# EAGLE board PhantomDriver_ER150D (EAGLE 7.4.0), part 1 of 2
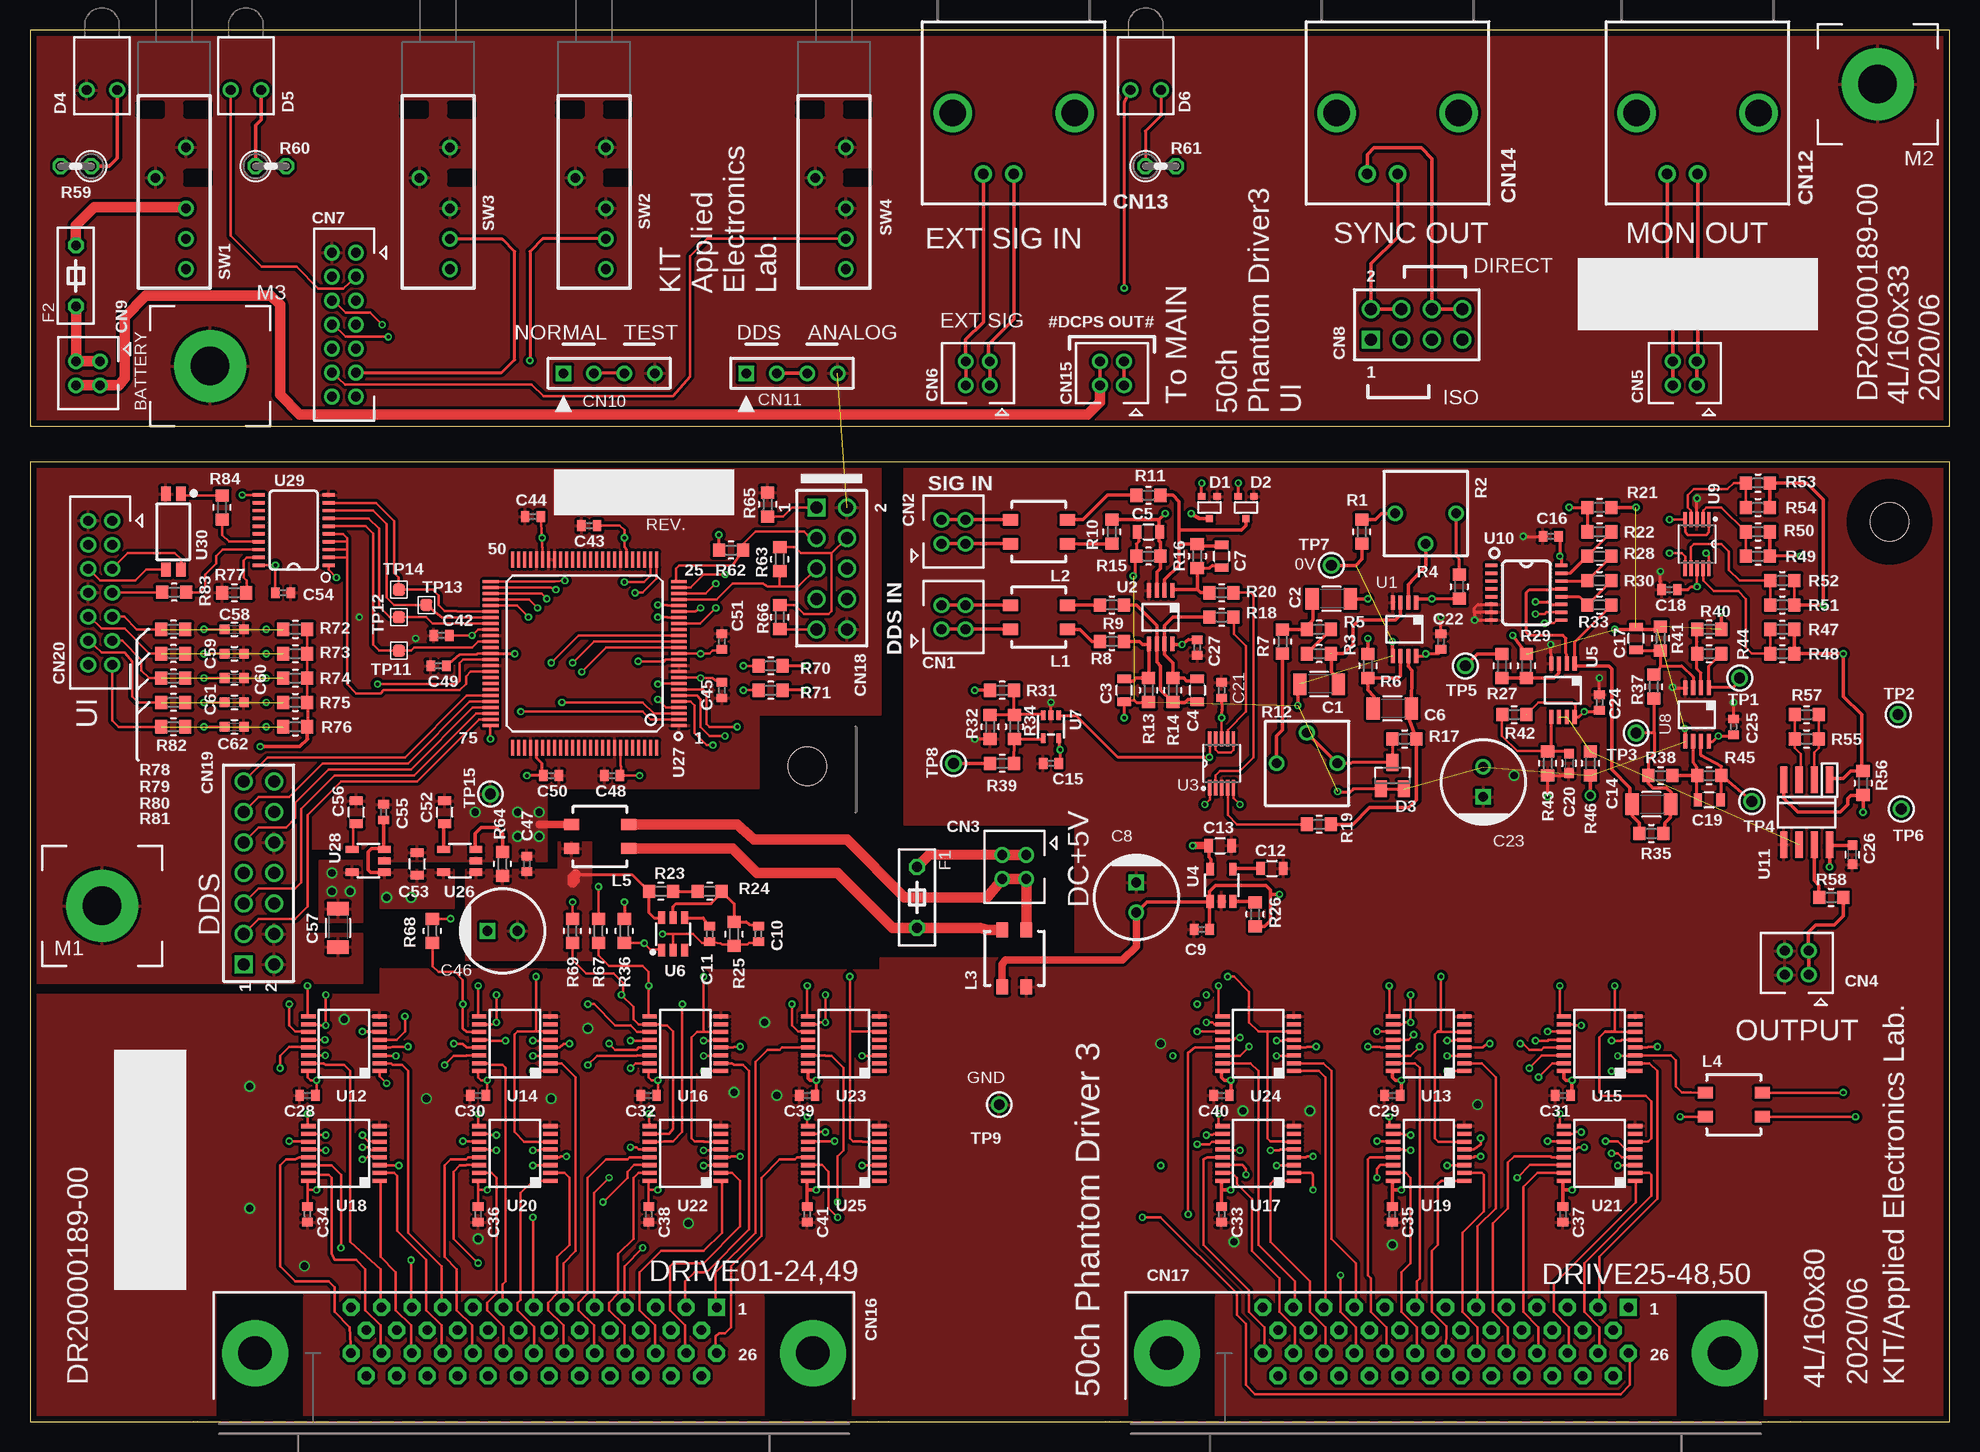
[diagram p5: board, top side]
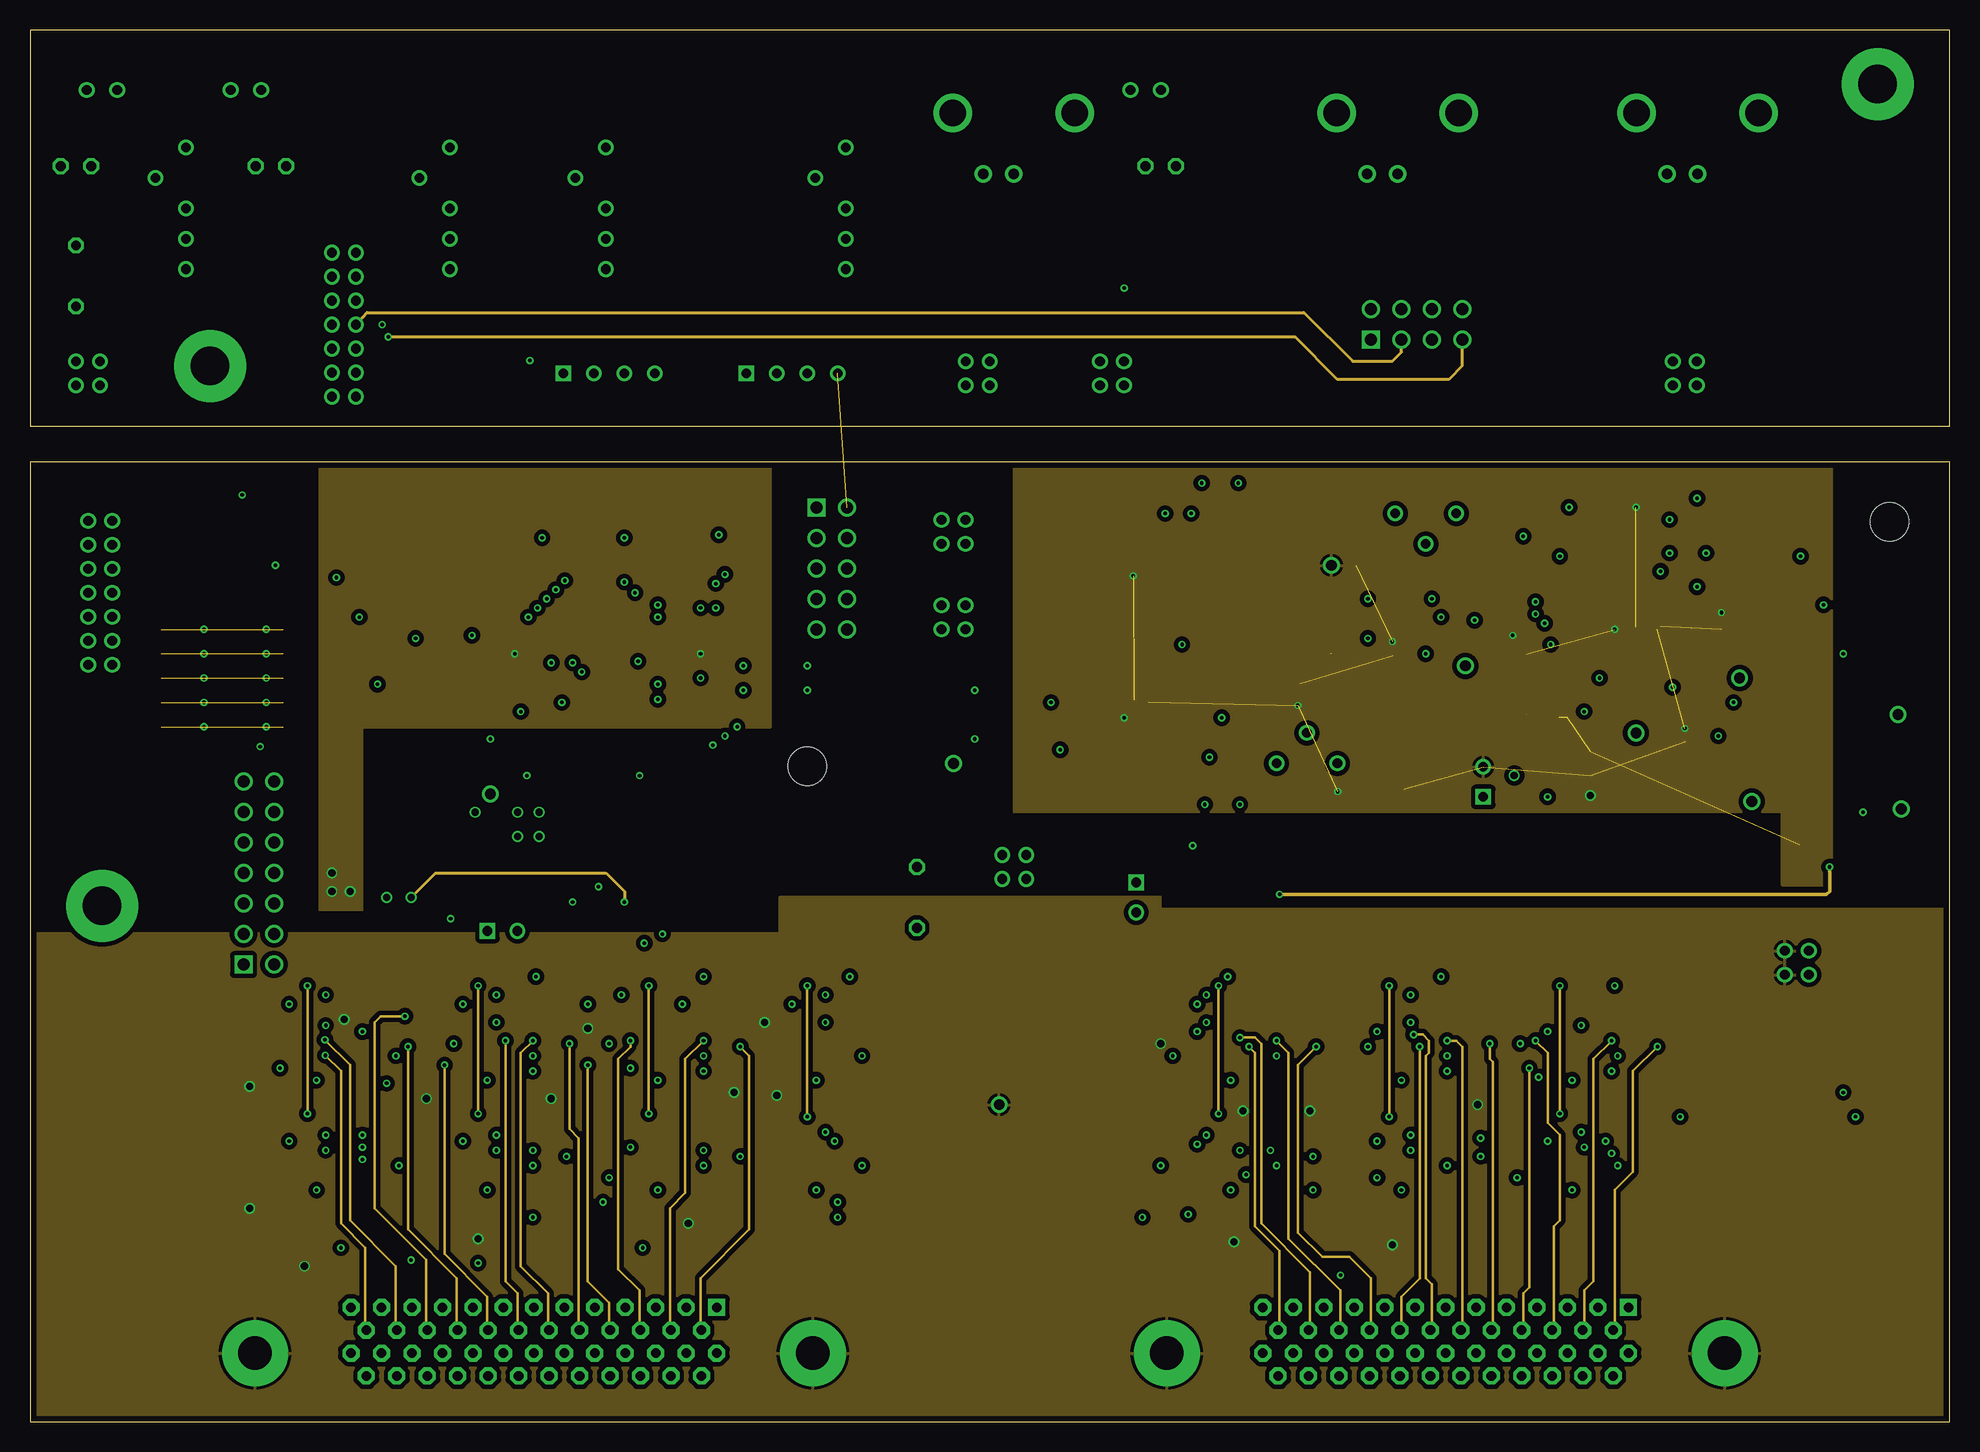
[diagram p6: board, inner layer Route2]
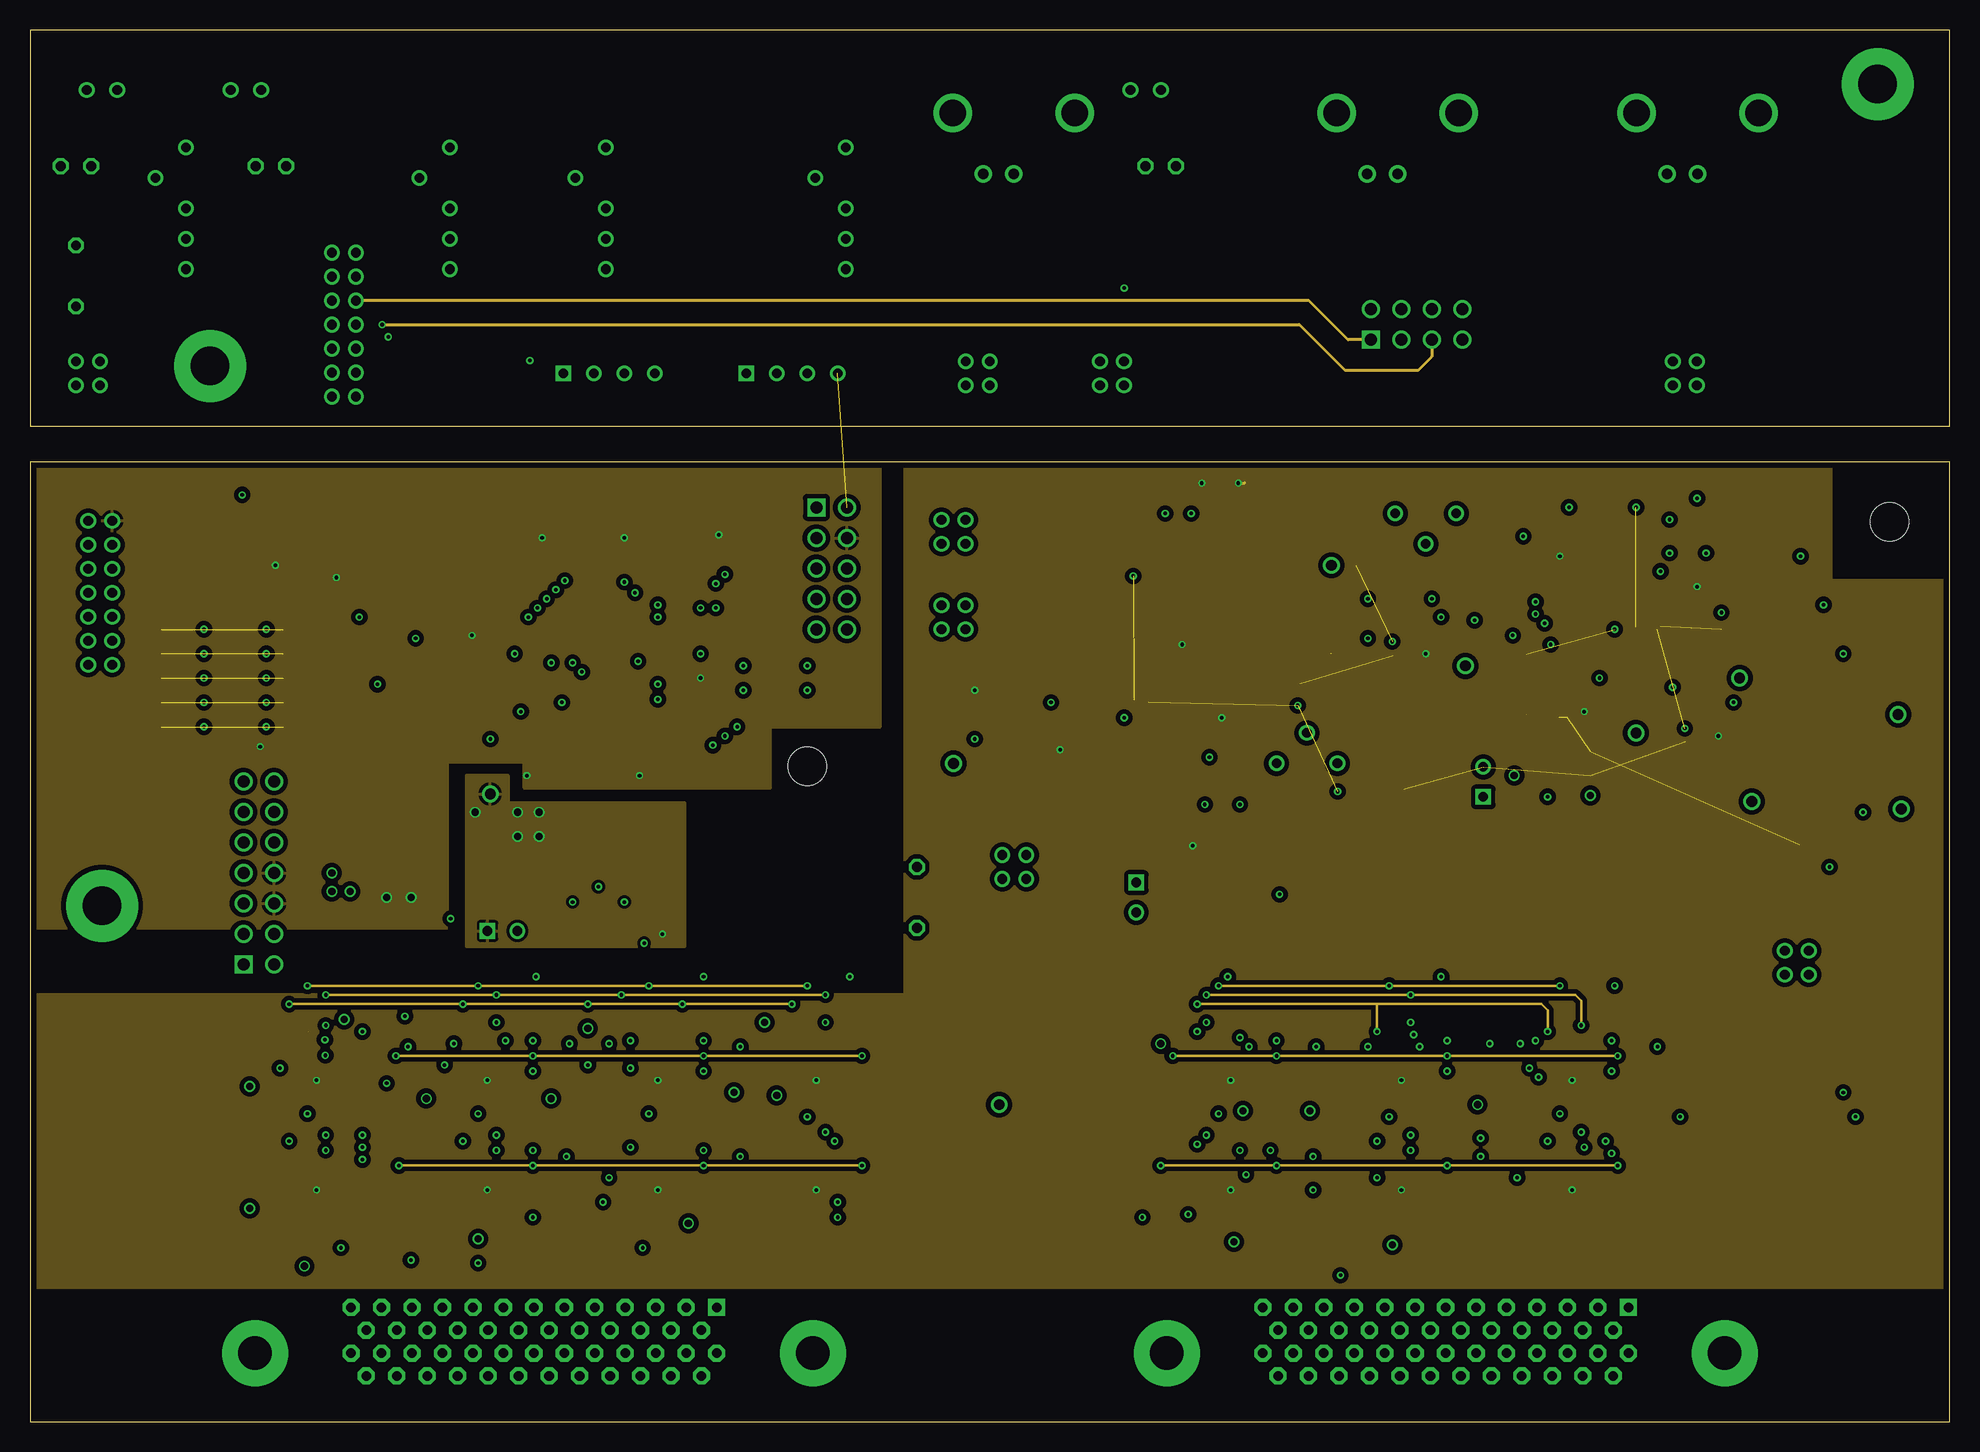
[diagram p7: board, inner layer Route15]
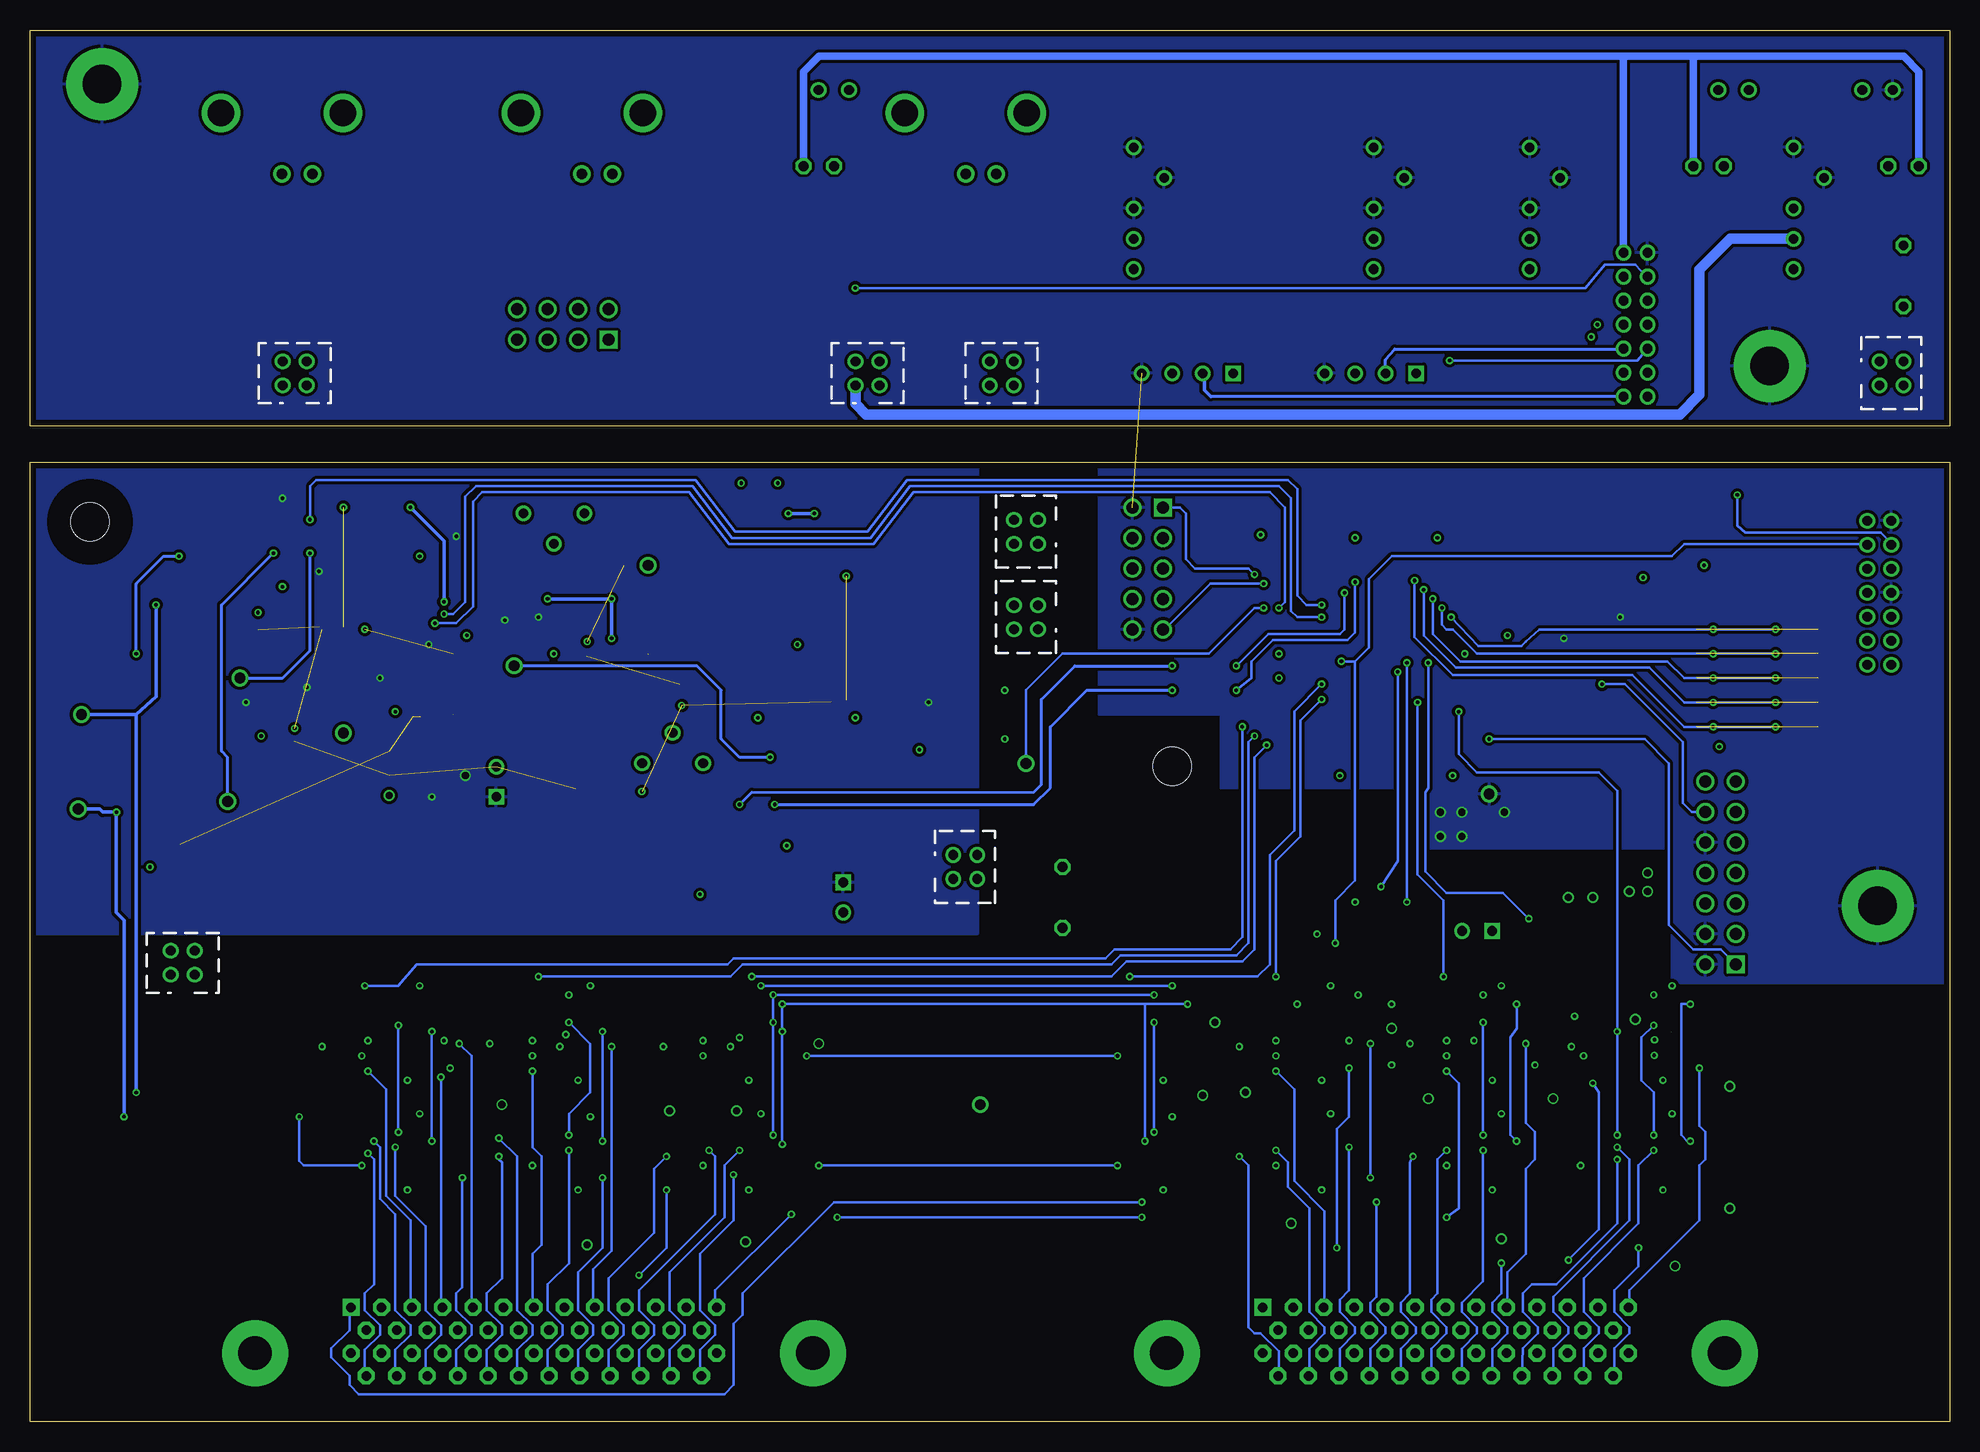
[diagram p8: board, bottom side, seen from below]

Size 160 x 116 mm. Coordinates in mm from the lower left corner, seen from the top.
Outline: 0,0 160,0 160,80 0,80 0,0
Outline: 0,83 160,83 160,116 0,116 0,83
Copper layers (1+2*15+16): Top 0.018mm / dielectric 0.25mm / Route2 0.035mm / dielectric 1mm / Route15 0.035mm / dielectric 0.25mm / Bottom 0.018mm
Design rules "pban_5mil-l4_2019 *": minimum track width 5mil, minimum drill 0.3mm, track to track 0.15mm, track to pad 0.15mm, pad to pad 5mil, via to via 0.3mm, smd to smd 5mil, copper to edge 0.5mm, drill to drill 0.5mm, minimum pad ring 0.25mm, minimum via ring 0.15mm, stop-mask expansion 0.05mm, vias tented up to drill 0.35mm, thermal gap 10mil
Holes 3.2 mm at 155,75
tRestrict: area 151.8,71.8 to 158.2,78.2
bRestrict: area 151.8,71.8 to 158.2,78.2

## Footprints (pad centres in the part's own frame; a part is rotated, then mirrored left to right if it is on the bottom)
CM3216 = smd 1.1 x 1.8: 1 -1.6,0; 2 1.6,0
CM2012 = smd 0.7 x 1.1: 1 -0.95,0; 2 0.95,0
PHI_6.3 = drill 0.8 square: NEG 0,-1.25 | drill 0.8: POS 0,1.25
CM1005 = smd 0.7 x 0.9: 1 -0.65,0; 2 0.65,0
CM1608 = smd 0.8 x 0.8: 1 -0.8,0; 2 0.8,0
DF11-4DP-2DSA = drill 0.8: 1 1,-1; 2 1,1; 3 -1,-1; 4 -1,1
DF11-14DP-2DSA = drill 0.8: 1 6,-1; 2 6,1; 3 4,-1; 4 4,1; 5 2,-1; 6 2,1; 7 0,-1; 8 0,1; 9 -2,-1; 10 -2,1; 11 -4,-1; 12 -4,1; 13 -6,-1; 14 -6,1
PIN_HEADER_8PIN = drill 1 square: 1 -3.81,-1.27 | drill 1: 2 -3.81,1.27; 3 -1.27,-1.27; 4 -1.27,1.27; 5 1.27,-1.27; 6 1.27,1.27; 7 3.81,-1.27; 8 3.81,1.27
PIN_HEADER_4PIN = drill 0.8 square: 1 0,0 | drill 0.8: 2 -2.54,0; 3 -5.08,0; 4 -7.62,0
BNC_F_ANGLE = drill 0.9 pad 1.422: P$1 0,0; P$2 -2.54,0 | drill 2.2: P$3 -5.08,5.08; P$4 5.08,5.08
50LFD2 = drill 0.8 pad 1.422 square: 1 -15.24,-3.815 | drill 0.8 pad 1.422 octagon: 2 -13.97,-1.91; 3 -12.7,-3.815; 4 -11.43,-1.91; 5 -10.16,-3.815; 6 -8.89,-1.91; 7 -7.62,-3.815; 8 -6.35,-1.91; 9 -5.08,-3.815; 10 -3.81,-1.91; 11 -2.54,-3.815; 12 -1.27,-1.91; 13 0,-3.815; 14 1.27,-1.91; 15 2.54,-3.815; 16 3.81,-1.91; 17 5.08,-3.815; 18 6.35,-1.91; 19 7.62,-3.815; 20 8.89,-1.91; 21 10.16,-3.815; 22 11.43,-1.91; 23 12.7,-3.815; 24 13.97,-1.91; 25 15.24,-3.815; 26 -15.24,-0.005; 27 -13.97,1.9; 28 -12.7,-0.005; 29 -11.43,1.9; 30 -10.16,-0.005; 31 -8.89,1.9; 32 -7.62,-0.005; 33 -6.35,1.9; 34 -5.08,-0.005; 35 -3.81,1.9; 36 -2.54,-0.005; 37 -1.27,1.9; 38 0,-0.005; 39 1.27,1.9; 40 2.54,-0.005; 41 3.81,1.9; 42 5.08,-0.005; 43 6.35,1.9; 44 7.62,-0.005; 45 8.89,1.9; 46 10.16,-0.005; 47 11.43,1.9; 48 12.7,-0.005; 49 13.97,1.9; 50 15.24,-0.005 | drill 2.8 pad 5.5: 51 -23.25,0; 52 23.25,0
PIN_HEADER_10PIN = drill 1 square: 1 -5.08,-1.27 | drill 1: 2 -5.08,1.27; 3 -2.54,-1.27; 4 -2.54,1.27; 5 0,-1.27; 6 0,1.27; 7 2.54,-1.27; 8 2.54,1.27; 9 5.08,-1.27; 10 5.08,1.27
PIN_HEADER_SOCKET_14PIN = drill 1 square: 1 -7.62,1.27 | drill 1: 2 -7.62,-1.27; 3 -5.08,1.27; 4 -5.08,-1.27; 5 -2.54,1.27; 6 -2.54,-1.27; 7 0,1.27; 8 0,-1.27; 9 2.54,1.27; 10 2.54,-1.27; 11 5.08,1.27; 12 5.08,-1.27; 13 7.62,1.27; 14 7.62,-1.27
SC70-3-R = smd 0.6 x 0.55: 1 -0.65,-0.925; 2 0.65,-0.925; 3 0,0.925
SOT23 = smd 1 x 1.4: 1 -0.95,-1.1; 2 0.95,-1.1; 3 0,1.1
L-93A8CB = drill 0.8: A 1.27,0; C -1.27,0
8X3/5.08 = drill 0.813 octagon: 1 -2.54,0; 2 2.54,0
ACM4520 = smd 1.25 x 0.95: 1 -2.375,1; 2 -2.375,-1; 3 2.375,-1; 4 2.375,1
VAB_3_10_CONTACT = drill 3.2 pad 6: CASE1 0,0
RM1608 = smd 1 x 1.1: 1 -1,0; 2 1,0
CT-6 = drill 0.8: 1 -2.54,0; 2 0,2.54; 3 2.54,0
0207/2V = drill 0.813 octagon: 1 -1.27,0; 2 1.27,0
A-12* = drill 0.8: 1 2.54,1; 2 0,1; 3 -2.54,1; 7 -7.62,1; 8 -5.08,-1.54
TP_TH_0R9MM = drill 0.9: 1 0,0
TP_PAD_1MM = smd 1 x 1: P$1 0,0
MSO8_AEL = smd 0.34 x 1.19: 1 -0.975,-2.23; 2 -0.325,-2.23; 3 0.325,-2.23; 4 0.975,-2.23; 5 0.975,2.23; 6 0.325,2.23; 7 -0.325,2.23; 8 -0.975,2.23
MSOP10 = smd 1.27 x 0.279: 1 -2.032,0.991; 2 -2.032,0.508; 3 -2.032,0; 4 -2.032,-0.508; 5 -2.032,-0.991; 6 2.032,-0.991; 7 2.032,-0.508; 8 2.032,0; 9 2.032,0.508; 10 2.032,0.991
SOT-23-5 = smd 0.6 x 1.05: 1 -0.95,-1.35; 2 0,-1.35; 3 0.95,-1.35; 4 0.95,1.35; 5 -0.95,1.35
SOT-23 = smd 0.6 x 1.05: 1 -0.95,-1.35; 2 0,-1.35; 3 0.95,-1.35; 4 0.95,1.35; 5 0,1.35; 6 -0.95,1.35
SC88A = smd 0.4 x 0.8: 1 -0.65,-0.95; 2 0,-0.95; 3 0.65,-0.95; 4 0.65,0.95; 5 -0.65,0.95
TSSOP16-P-044-065A = smd 0.29 x 1: 1 -2.275,-2.9; 2 -1.625,-2.9; 3 -0.975,-2.9; 4 -0.325,-2.9; 5 0.325,-2.9; 6 0.975,-2.9; 7 1.625,-2.9; 8 2.275,-2.9; 9 2.275,2.9; 10 1.625,2.9; 11 0.975,2.9; 12 0.325,2.9; 13 -0.325,2.9; 14 -0.975,2.9; 15 -1.625,2.9; 16 -2.275,2.9
SO8_AEL = smd 0.6 x 2.2: 1 -1.905,-2.7; 2 -0.635,-2.7; 3 0.635,-2.7; 4 1.905,-2.7; 5 1.905,2.7; 6 0.635,2.7; 7 -0.635,2.7; 8 -1.905,2.7
TSSOP16_AEL = smd 0.34 x 1.19: 1 -2.275,-2.97; 2 -1.625,-2.97; 3 -0.975,-2.97; 4 -0.325,-2.97; 5 0.325,-2.97; 6 0.975,-2.97; 7 1.625,-2.97; 8 2.275,-2.97; 9 2.275,2.97; 10 1.625,2.97; 11 0.975,2.97; 12 0.325,2.97; 13 -0.325,2.97; 14 -0.975,2.97; 15 -1.625,2.97; 16 -2.275,2.97
QFP100_0.5 = smd 1.3 x 0.25: 1 -7.85,6; 2 -7.85,5.5; 3 -7.85,5; 4 -7.85,4.5; 5 -7.85,4; 6 -7.85,3.5; 7 -7.85,3; 8 -7.85,2.5; 9 -7.85,2; 10 -7.85,1.5; 11 -7.85,1; 12 -7.85,0.5; 13 -7.85,0; 14 -7.85,-0.5; 15 -7.85,-1; 16 -7.85,-1.5; 17 -7.85,-2; 18 -7.85,-2.5; 19 -7.85,-3; 20 -7.85,-3.5; 21 -7.85,-4; 22 -7.85,-4.5; 23 -7.85,-5; 24 -7.85,-5.5; 25 -7.85,-6; 51 7.85,-6; 52 7.85,-5.5; 53 7.85,-5; 54 7.85,-4.5; 55 7.85,-4; 56 7.85,-3.5; 57 7.85,-3; 58 7.85,-2.5; 59 7.85,-2; 60 7.85,-1.5; 61 7.85,-1; 62 7.85,-0.5; 63 7.85,0; 64 7.85,0.5; 65 7.85,1; 66 7.85,1.5; 67 7.85,2; 68 7.85,2.5; 69 7.85,3; 70 7.85,3.5; 71 7.85,4; 72 7.85,4.5; 73 7.85,5; 74 7.85,5.5; 75 7.85,6 | smd 0.25 x 1.3: 26 -6,-7.85; 27 -5.5,-7.85; 28 -5,-7.85; 29 -4.5,-7.85; 30 -4,-7.85; 31 -3.5,-7.85; 32 -3,-7.85; 33 -2.5,-7.85; 34 -2,-7.85; 35 -1.5,-7.85; 36 -1,-7.85; 37 -0.5,-7.85; 38 0,-7.85; 39 0.5,-7.85; 40 1,-7.85; 41 1.5,-7.85; 42 2,-7.85; 43 2.5,-7.85; 44 3,-7.85; 45 3.5,-7.85; 46 4,-7.85; 47 4.5,-7.85; 48 5,-7.85; 49 5.5,-7.85; 50 6,-7.85; 76 6,7.85; 77 5.5,7.85; 78 5,7.85; 79 4.5,7.85; 80 4,7.85; 81 3.5,7.85; 82 3,7.85; 83 2.5,7.85; 84 2,7.85; 85 1.5,7.85; 86 1,7.85; 87 0.5,7.85; 88 0,7.85; 89 -0.5,7.85; 90 -1,7.85; 91 -1.5,7.85; 92 -2,7.85; 93 -2.5,7.85; 94 -3,7.85; 95 -3.5,7.85; 96 -4,7.85; 97 -4.5,7.85; 98 -5,7.85; 99 -5.5,7.85; 100 -6,7.85
TSSOP20-P-0044-065A = smd 0.29 x 1: 1 -2.925,-2.9; 2 -2.275,-2.9; 3 -1.625,-2.9; 4 -0.975,-2.9; 5 -0.325,-2.9; 6 0.325,-2.9; 7 0.975,-2.9; 8 1.625,-2.9; 9 2.275,-2.9; 10 2.925,-2.9; 11 2.925,2.9; 12 2.275,2.9; 13 1.625,2.9; 14 0.975,2.9; 15 0.325,2.9; 16 -0.325,2.9; 17 -0.975,2.9; 18 -1.625,2.9; 19 -2.275,2.9; 20 -2.925,2.9
SO4(11-3C1)(TOSHIBA) = smd 0.8 x 1.2: 1 -0.635,-3.15; 2 0.635,-3.15; 3 0.635,3.15; 4 -0.635,3.15
3MM_STAT = hole 3.2: 0,0

## Placement (x,y rotation side)
C1  47n  [CM3216]  107.46,61.47 180 top
C2  47n  [CM3216]  108.47,68.58 180 top
C3  3.3n  [CM2012]  91.2,60.96 90 top
C4  3.3n  [CM2012]  97.3,60.96 270 top
C5  3.3n  [CM2012]  93.23,74.17 0 top
C6  47n  [CM3216]  113.55,59.44 180 top
C7  3.3n  [CM2012]  99.33,72.14 90 top
C8  56u/10V/OS  [PHI_6.3]  92.22,43.69 180 top
C9  0.1u/16V  [CM1005]  97.68,41.02 180 top
C10  0.1u/16V  [CM1005]  60.72,40.64 270 top
C11  0.1u/16V  [CM1005]  56.66,40.64 270 top
C12  10n  [CM2012]  103.52,46.1 0 top
C13  4.7u/25V  [CM2012]  99.2,48.01 0 top
C14  ---  [CM3216]  135.14,51.44 180 top
C15  0.1u/16V  [CM1005]  85.1,54.86 0 top
C16  0.1u/16V  [CM1005]  126.76,73.79 180 top
C17  4.7n  [CM2012]  133.87,65.28 90 top
C18  0.1u/16V  [CM1005]  136.67,69.34 180 top
C19  2.2n  [CM2012]  139.97,51.82 180 top
C20  1u/25V  [CM1608]  128.28,54.86 270 top
C21  0.1u/16V  [CM1005]  99.33,60.96 90 top
C22  0.1u/16V  [CM1005]  117.62,65.02 90 top
C23  56u/10V/OS  [PHI_6.3]  121.14,53.32 0 top
C24  0.1u/16V  [CM1005]  130.82,59.94 90 top
C25  0.1u/16V  [CM1005]  142,57.91 90 top
C26  1u/25V  [CM1608]  151.91,47.24 90 top
C27  0.1u/16V  [CM1005]  97.3,64.52 270 top
C28  0.1u/16V  [CM1005]  23.13,27.18 180 top
C29  0.1u/16V  [CM1005]  113.55,27.18 180 top
C30  0.1u/16V  [CM1005]  37.35,27.18 180 top
C31  0.1u/16V  [CM1005]  127.78,27.18 180 top
C32  0.1u/16V  [CM1005]  51.58,27.18 180 top
C33  0.1u/16V  [CM1005]  99.33,17.27 270 top
C34  0.1u/16V  [CM1005]  23.13,17.27 270 top
C35  0.1u/16V  [CM1005]  113.55,17.27 270 top
C36  0.1u/16V  [CM1005]  37.35,17.27 270 top
C37  0.1u/16V  [CM1005]  127.78,17.27 270 top
C38  0.1u/16V  [CM1005]  51.58,17.27 270 top
C39  0.1u/16V  [CM1005]  64.78,27.18 180 top
C40  0.1u/16V  [CM1005]  99.33,27.18 180 top
C41  0.1u/16V  [CM1005]  64.78,17.27 270 top
C42  0.1u/16V  [CM1005]  34.3,65.53 180 top
C43  0.1u/16V  [CM1005]  46.62,74.68 180 top
C44  0.1u/16V  [CM1005]  41.92,75.44 180 top
C45  0.1u/16V  [CM1005]  57.67,60.96 270 top
C46  56u/10V/OS  [PHI_6.3]  39.38,40.89 270 top
C47  0.1u/16V  [CM1005]  41.42,46.48 90 top
C48  0.1u/16V  [CM1005]  48.53,53.85 0 top
C49  0.1u/16V  [CM1005]  34.05,62.99 0 top
C50  0.1u/16V  [CM1005]  43.45,53.85 180 top
C51  0.1u/16V  [CM1005]  57.67,65.02 270 top
C52  10n  [CM2012]  34.56,50.8 90 top
C53  4.7u/25V  [CM2012]  32.27,46.48 90 top
C54  0.1u/16V  [CM1005]  21.1,69.09 0 top
C55  0.1u/16V  [CM1005]  29.48,50.8 90 top
C56  10n  [CM2012]  27.19,50.8 90 top
C57  10u/25V  [CM3216]  25.67,41.15 270 top
C58  1u/25V  [CM1608]  17.03,66.04 0 top
C59  1u/25V  [CM1608]  17.03,64.01 0 top
C60  1u/25V  [CM1608]  17.03,61.98 0 top
C61  1u/25V  [CM1608]  17.03,59.94 0 top
C62  1u/25V  [CM1608]  17.03,57.91 0 top
CN1  DF11-4DP-2DSA  [DF11-4DP-2DSA]  76.98,67.06 270 top
CN2  DF11-4DP-2DSA  [DF11-4DP-2DSA]  76.98,74.17 270 top
CN3  DF11-4DP-2DSA  [DF11-4DP-2DSA]  82.06,46.23 90 top
CN4  DF11-4DP-2DSA  [DF11-4DP-2DSA]  147.27,38.24 0 top
CN5  DF11-4DP-2DSA  [DF11-4DP-2DSA]  137.94,87.38 0 top
CN6  DF11-4DP-2DSA  [DF11-4DP-2DSA]  79.01,87.38 0 top
CN7  DF11-14DP-2DSA  [DF11-14DP-2DSA]  26.18,91.44 90 top
CN8  PH-2X4S  [PIN_HEADER_8PIN]  115.58,91.44 0 top
CN9  DF11-4DP-2DSA  [DF11-4DP-2DSA]  4.84,87.38 90 top
CN10  826646-4  [PIN_HEADER_4PIN]  44.46,87.38 180 top
CN11  826646-4  [PIN_HEADER_4PIN]  59.7,87.38 180 top
CN12  BNC_ANGLE  [BNC_F_ANGLE]  139,104 0 top
CN13  BNC_ANGLE  [BNC_F_ANGLE]  82,104 0 top
CN14  BNC_ANGLE  [BNC_F_ANGLE]  114,104 0 top
CN15  DF11-4DP-2DSA  [DF11-4DP-2DSA]  90.18,87.38 0 top
CN16  PCS-XE50LFD  [50LFD2]  42,5.7 180 top
CN17  PCS-XE50LFD  [50LFD2]  118,5.7 180 top
CN18  PH-2X5S  [PIN_HEADER_10PIN]  66.82,71.12 270 top
CN19  PIN_HEADER_SOCKET_14PIN  [PIN_HEADER_SOCKET_14PIN]  19.06,45.72 90 top
CN20  DF11-14DP-2DSA  [DF11-14DP-2DSA]  5.86,69.09 90 top
D1  1SS372  [SC70-3-R]  98.31,76.2 180 top
D2  1SS372  [SC70-3-R]  101.36,76.2 180 top
D3  1SS226  [SOT23]  113.55,53.85 0 top
D4  L-93A8CB/1GD  [L-93A8CB]  6,111 0 top
D5  L-93A8CB/1ID  [L-93A8CB]  18,111 0 top
D6  L-93A8CB/1GD  [L-93A8CB]  93,111 0 top
F1  RXEF050  [8X3/5.08]  73.93,43.69 270 top
F2  RXEF050  [8X3/5.08]  3.82,95.5 90 top
L1  ACM4520-142  [ACM4520]  84.09,67.06 180 top
L2  ACM4520-142  [ACM4520]  84.09,74.17 180 top
L3  ACM4520-142  [ACM4520]  82.06,38.61 90 top
L4  ACM4520-142  [ACM4520]  142,26.42 0 top
L5  ACM4520-142  [ACM4520]  47.51,48.77 180 top
M1  VAB-3-10  [VAB_3_10_CONTACT]  6,43 0 top
M2  VAB-3-10  [VAB_3_10_CONTACT]  154,111.5 0 top
M3  VAB-3-10  [VAB_3_10_CONTACT]  15,88 0 top
R1  100k  [RM1608]  111.01,74.17 90 top
R2  100k/POT  [CT-6]  116.35,75.69 180 top
R3  270k  [RM1608]  107.46,64.01 180 top
R4  47k  [RM1608]  119.14,69.6 270 top
R5  43k  [RM1608]  107.46,66.04 180 top
R6  330k  [RM1608]  111.52,62.99 270 top
R7  270k  [RM1608]  104.41,65.02 270 top
R8  51k  [RM1608]  90.18,65.02 0 top
R9  51k  [RM1608]  90.18,68.07 0 top
R10  51k  [RM1608]  90.18,74.17 90 top
R11  51k  [RM1608]  93.23,77.22 0 top
R12  50k/POT  [CT-6]  106.44,54.86 0 top
R13  51k  [RM1608]  93.23,60.96 270 top
R14  51k  [RM1608]  95.26,60.96 90 top
R15  51k  [RM1608]  93.23,72.14 180 top
R16  51k  [RM1608]  97.3,72.14 270 top
R17  9.1k  [RM1608]  114.57,56.9 0 top
R18  47/THICK  [RM1608]  99.33,67.06 0 top
R19  10k  [RM1608]  107.46,49.78 180 top
R20  10k  [RM1608]  99.33,69.09 0 top
R21  51k  [RM1608]  130.82,76.2 180 top
R22  0  [RM1608]  130.82,74.17 0 top
R23  9.1k  [RM1608]  52.59,44.2 180 top
R24  110k  [RM1608]  56.66,44.2 180 top
R25  11k  [RM1608]  58.69,40.64 90 top
R26  100k/THICK  [RM1608]  102.12,42.29 90 top
R27  0  [RM1608]  122.7,62.99 270 top
R28  0  [RM1608]  130.82,72.14 0 top
R29  10k  [RM1608]  124.73,62.99 270 top
R30  51k  [RM1608]  130.82,70.1 0 top
R31  51k  [RM1608]  81.04,60.96 180 top
R32  51k  [RM1608]  80.02,57.91 90 top
R33  0  [RM1608]  130.82,68.07 0 top
R34  1M/THICK  [RM1608]  82.06,57.91 270 top
R35  0  [RM1608]  135.14,49.02 0 top
R36  100k/THICK  [RM1608]  49.54,40.89 90 top
R37  51k  [RM1608]  135.35,61.26 90 top
R38  51k  [RM1608]  135.9,53.85 0 top
R39  47/THICK  [RM1608]  81.04,54.86 180 top
R40  51k  [RM1608]  139.97,66.04 180 top
R41  51k  [RM1608]  135.9,65.28 270 top
R42  68k  [RM1608]  123.71,58.93 0 top
R43  68k  [RM1608]  126.51,54.86 90 top
R44  51k  [RM1608]  139.97,64.01 0 top
R45  51k  [RM1608]  139.97,53.85 0 top
R46  30/THICK  [RM1608]  130.06,54.86 270 top
R47  100k  [RM1608]  146.06,66.04 0 top
R48  100k  [RM1608]  146.06,64.01 0 top
R49  5.6k  [RM1608]  144.03,72.14 0 top
R50  39k  [RM1608]  144.03,74.17 0 top
R51  100k  [RM1608]  146.06,68.07 0 top
R52  100k  [RM1608]  146.06,70.1 0 top
R53  10k  [RM1608]  144.03,78.23 0 top
R54  10k  [RM1608]  144.03,76.2 0 top
R55  2k/0.05%/10ppm  [RM1608]  148.1,56.9 0 top
R56  100/0.05%/10ppm  [RM1608]  152.79,53.21 270 top
R57  15k/0.05%/10ppm  [RM1608]  148.1,58.93 0 top
R58  620/THICK  [RM1608]  150.13,43.69 0 top
R59  680/LEAD  [0207/2V]  3.82,104.65 180 top
R60  680/LEAD  [0207/2V]  20.08,104.65 0 top
R61  680/LEAD  [0207/2V]  94.25,104.65 0 top
R62  ---  [RM1608]  58.43,72.64 180 top
R63  10k/THICK  [RM1608]  62.5,71.88 90 top
R64  100k/THICK  [RM1608]  39.38,46.48 90 top
R65  1k/THICK  [RM1608]  61.48,76.45 270 top
R66  10k/THICK  [RM1608]  62.5,67.06 90 top
R67  1k/THICK  [RM1608]  47.38,40.89 90 top
R68  1k/THICK  [RM1608]  33.54,40.89 90 top
R69  1k/THICK  [RM1608]  45.23,40.89 90 top
R70  1k/THICK  [RM1608]  61.74,62.99 180 top
R71  1k/THICK  [RM1608]  61.74,60.96 180 top
R72  100k/THICK  [RM1608]  22.11,66.04 0 top
R73  100k/THICK  [RM1608]  22.11,64.01 0 top
R74  100k/THICK  [RM1608]  22.11,61.98 0 top
R75  100k/THICK  [RM1608]  22.11,59.94 0 top
R76  100k/THICK  [RM1608]  22.11,57.91 0 top
R77  100k/THICK  [RM1608]  17.03,69.09 0 top
R78  20k/THICK  [RM1608]  11.95,66.04 180 top
R79  20k/THICK  [RM1608]  11.95,64.01 180 top
R80  20k/THICK  [RM1608]  11.95,61.98 180 top
R81  20k/THICK  [RM1608]  11.95,59.94 180 top
R82  20k/THICK  [RM1608]  11.95,57.91 180 top
R83  1k/THICK  [RM1608]  12.02,69.14 180 top
R84  2k/THICK  [RM1608]  16.02,76.2 90 top
SW1  A-12AV  [A-12*]  12,98.6 270 top
SW2  A-12AV  [A-12*]  47,98.6 270 top
SW3  A-12AV  [A-12*]  34,98.6 270 top
SW4  A-12AV  [A-12*]  67,98.6 270 top
TP1  TP-LC3G  [TP_TH_0R9MM]  142.51,61.98 0 top
TP2  TP-LC3G  [TP_TH_0R9MM]  155.72,58.93 0 top
TP3  TP-LC3G  [TP_TH_0R9MM]  133.87,57.4 0 top
TP4  TP-LC3G  [TP_TH_0R9MM]  143.52,51.69 0 top
TP5  TP-LC3G  [TP_TH_0R9MM]  119.65,62.99 0 top
TP6  TP-LC3G  [TP_TH_0R9MM]  155.97,51.05 0 top
TP7  TP-LC3G  [TP_TH_0R9MM]  108.47,71.37 0 top
TP8  TP-LC3G  [TP_TH_0R9MM]  76.98,54.86 90 top
TP9  TP-LC3G  [TP_TH_0R9MM]  80.79,26.42 180 top
TP11  TP-1MMPAD  [TP_PAD_1MM]  30.75,64.26 0 top
TP12  TP-1MMPAD  [TP_PAD_1MM]  30.75,67.06 0 top
TP13  TP-1MMPAD  [TP_PAD_1MM]  33.03,68.07 0 top
TP14  TP-1MMPAD  [TP_PAD_1MM]  30.75,69.34 0 top
TP15  TP-LC3G  [TP_TH_0R9MM]  38.37,52.32 90 top
U1  OPA2344EA  [MSO8_AEL]  114.57,66.04 180 top
U2  OPA2344EA  [MSO8_AEL]  94.25,67.06 180 top
U3  TS5A23159DGS  [MSOP10]  99.33,54.86 90 top
U4  TPS79933DDC  [SOT-23-5]  99.33,44.7 0 top
U5  OPA2344EA  [MSO8_AEL]  127.78,60.96 180 top
U6  TPS3808G01DBV  [SOT-23]  53.61,40.64 0 top
U7  NJU7108F3  [SC88A]  85.1,57.91 180 top
U8  OPA2344EA  [MSO8_AEL]  138.95,58.93 180 top
U9  TS5A23159DGS  [MSOP10]  138.95,73.15 270 top
U10  74VHC4052AFT  [TSSOP16-P-044-065A]  124.73,69.09 270 top
U11  AD8227ARZ  [SO8_AEL]  148.1,50.8 180 top
U12  MAX4617CUE+  [TSSOP16_AEL]  26.18,31.5 90 top
U13  MAX4617CUE+  [TSSOP16_AEL]  116.6,31.5 90 top
U14  MAX4617CUE+  [TSSOP16_AEL]  40.4,31.5 90 top
U15  MAX4617CUE+  [TSSOP16_AEL]  130.82,31.5 90 top
U16  MAX4617CUE+  [TSSOP16_AEL]  54.62,31.5 90 top
U17  MAX4617CUE+  [TSSOP16_AEL]  102.38,22.35 90 top
U18  MAX4617CUE+  [TSSOP16_AEL]  26.18,22.35 90 top
U19  MAX4617CUE+  [TSSOP16_AEL]  116.6,22.35 90 top
U20  MAX4617CUE+  [TSSOP16_AEL]  40.4,22.35 90 top
U21  MAX4617CUE+  [TSSOP16_AEL]  130.82,22.35 90 top
U22  MAX4617CUE+  [TSSOP16_AEL]  54.62,22.35 90 top
U23  MAX4617CUE+  [TSSOP16_AEL]  67.83,31.5 90 top
U24  MAX4617CUE+  [TSSOP16_AEL]  102.38,31.5 90 top
U25  MAX4617CUE+  [TSSOP16_AEL]  67.83,22.35 90 top
U26  TPS79933DDC  [SOT-23-5]  35.83,46.74 90 top
U27  5M160ZT100  [QFP100_0.5]  46.24,64.01 180 top
U28  TPS79918DDC  [SOT-23-5]  28.21,46.74 90 top
U29  74VHC9541FT  [TSSOP20-P-0044-065A]  21.98,74.31 90 top
U30  TLP291GR  [SO4(11-3C1)(TOSHIBA)]  11.95,74.17 180 top
U$2  [3MM_STAT]  64.78,54.61 0 top

## Tracks (layer width: path | path; a pad name or v marks a point on that pad's centre or on a via)
0V  (via drill 0.3, 0.6)  (12 unrouted)
  Top 0.254: R13.2 93.22,59.94 92.22,59.94 92,60.16 C3.1 v91.2,58.67 | C5.1 92.43,73.37 92.22,73.15 92.22,72.15 R15.2 92.23,72.03 92.09,71.88 92.09,70.61 v91.96,70.48 | D3.2 D3.1 110.29,52.75 110,52.45 109.06,52.45 v108.99,52.52
  Top 0.305: U8.5 137.98,57.73 v137.94,57.78 | v105.68,59.69 105.68,60.96 C1.2 | U1.5 v113.55,65.02 | v123.6,65.53 R29.1 | R21.1 v133.87,76.2 | R40.1 v140.98,67.44 | R41.1 135.65,66.04 134.13,66.04 C17.2 133.55,66.23 133.36,66.04 v132.09,66.04 | v130.06,52.19 R46.2 | TP7.1 110.5,71.37 111.01,71.88 R1.1
  pour Route2 (isolate 0.381): 82.06,80.26 150.13,80.26 150.13,44.7 146.06,44.7 146.06,50.8 82.06,50.8
80_POWER
  Top 0.305: U4.3 102.04,43.35 102,43.43 102.12,43.31 R26.2
!CS0  (via drill 0.3)
  Top 0.203: v27.7,23.88 28.21,23.37 29.11,23.37 U18.6 | U27.2 51.74,58.51 51.07,59.18 v40.91,59.18 | U12.6 28.76,32.47 28.72,32.51 v27.7,32.51 27.74,32.47 U12.6
  Bottom 0.203: v27.7,23.88 v27.7,32.51 27.7,52.58 29.22,54.1 39.38,54.1 40.91,55.63 v40.91,59.18
!CS1  (via drill 0.3)
  Top 0.203: U20.6 41.2,23.33 40.4,24.13 40.4,32.26 40.65,32.51 42.18,32.51 | U14.6 43.33,32.51 42.18,32.51 | 42.18,32.51 v42.18,37.08 | U27.3 52,59.01 51.07,59.94 v44.34,59.94
  Bottom 0.203: v42.18,37.08 42.18,43.43 44.34,45.59 v44.34,59.94
!CS2  (via drill 0.3)
  Top 0.203: 56.11,32.47 U16.6 | U22.6 56.19,23.33 56.15,23.37 55.39,23.37 55.13,23.62 55.13,32 55.6,32.47 56.11,32.47 | 56.11,32.47 56.15,32.51 v56.15,37.08 | U27.4 53.03,59.51 v52.34,60.2
  Bottom 0.203: v56.15,37.08 56.15,46.74 54.12,48.77 54.12,58.42 v52.34,60.2
!CS3  (via drill 0.3)
  Top 0.203: U24.6 104.92,32.51 103.14,32.51 | U17.6 104.45,23.33 104.41,23.37 103.39,23.37 103.14,23.62 103.14,32.51 | v99.84,37.08 100.34,37.08 101.61,35.81 101.61,33.27 102.38,32.51 103.14,32.51 | U27.5 55.07,60.01 55.39,59.69 55.39,57.4 56.4,56.39 v56.91,56.39
  Bottom 0.203: v99.84,37.08 69.86,37.08 68.59,38.35 58.94,38.35 57.93,39.37 57.93,55.37 v56.91,56.39
!CS4  (via drill 0.3)
  Top 0.203: 117.32,32.47 U13.6 | 117.32,32.47 117.11,32.26 117.11,23.62 117.4,23.33 U19.6 | 117.32,32.47 117.36,32.51 117.62,32.51 v117.62,37.08 | U27.6 55.58,60.51 55.89,60.2 55.89,57.91 56.66,57.15 v57.93,57.15
  Bottom 0.203: v117.62,37.08 101.61,37.08 100.6,38.1 69.86,38.1 69.1,38.86 59.45,38.86 58.43,39.88 58.43,56.64 v57.93,57.15
!CS5  (via drill 0.3)
  Top 0.203: U21.6 134.89,23.37 135.14,23.62 135.14,26.67 134.68,27.14 131.12,27.14 130.82,27.43 130.82,32 131.29,32.47 | 131.29,32.47 U15.6 | 131.29,32.47 131.33,32.51 132.09,32.51 v132.09,36.32 | U27.7 56.1,61.01 56.4,60.71 56.4,58.17 56.66,57.91 v58.94,57.91
  Bottom 0.203: v132.09,36.32 129.3,36.32 127.78,38.1 101.87,38.1 101.36,38.61 70.37,38.61 69.61,39.37 59.96,39.37 58.94,40.39 v58.94,57.91
!CS6  (via drill 0.3)
  Top 0.203: U23.6 70.41,32.47 70.37,32.51 68.34,32.51 | 68.34,32.51 68.34,23.62 68.59,23.37 69.36,23.37 69.4,23.33 U25.6 | 68.34,32.51 v68.34,37.08 | U27.8 52.63,61.51 52.59,61.47 v52.34,61.47
  Bottom 0.203: v68.34,37.08 57.67,37.08 56.66,38.1 56.66,47.24 54.62,49.28 54.62,59.18 v52.34,61.47
!LOW_BAT  (via drill 0.3)
  Top 0.203: U6.1 52.59,39.22 | R36.1 51.18,39.89 v51.2,39.88 51.7,39.37 52.58,39.37 | U27.12 52.98,63.51 52.85,63.37 v50.69,63.37
  Top 0.254: 52.58,39.37 U6.1
  Bottom 0.203: v51.2,39.88 51.2,43.43 49.54,45.09 49.54,63.37 | 49.54,63.37 v50.69,63.37 | 49.54,63.37 48.4,64.52 48.4,70.23 46.5,72.14 23.13,72.14 22.11,73.15 6.92,73.15 CN20.3
AGND  (via drill 0.3, 0.6)
  Top 0.254: C22.2 v117.62,67.06 | U8.4 136.98,61.16 v136.92,61.21 | C25.2 v142,59.94 | C24.2 v130.82,61.98 | U5.4 126.8,63.97 126.76,64.01 v126.76,64.77 | C20.2 128.59,53.86 R43.1 v126.51,52.07 | U10.6 120.7,68.11 120.41,67.82 120.41,67.44 | 120.41,67.44 v120.41,66.8 120.42,66.81 U10.8 | U10.7 121.07,67.46 120.92,67.44 120.41,67.44 | v124.47,73.79 C16.2 | U9.3 v138.95,76.96 | C18.2 135.87,70.07 135.9,70.1 v135.9,70.87 | U7.2 v85.1,59.94 | 84.3,54.9 C15.1 84.34,55.08 | R32.1 78.77,56.91 v78.75,56.9
  other vias: 123.71,53.85 62.24,27.18 101.11,25.91 106.69,25.91 100.34,14.99 120.66,26.42 113.55,14.73 94.25,31.5 61.23,33.27 58.69,27.43 43.45,26.92 33.03,26.92 26.18,33.53 22.87,12.95 37.35,15.24 46.5,32.77 18.3,27.94 18.3,17.78 54.88,16.51
  pour Top (isolate 0.254): 87.14,49.78 87.14,38.61 70.88,38.61 70.88,37.59 29.22,37.72 29.22,35.56 -0.24,35.56 -0.24,0 160.29,0 160.29,80.26 72.91,80.26 72.91,49.78
  pour Route2 (isolate 0.381): -0.24,0 160.29,0 160.29,42.67 94.25,42.67 94.25,43.69 62.5,43.69 62.5,40.64 -0.24,40.64
  pour Bottom (isolate 0.254): 81.04,40.64 160.29,40.64 160.29,80.26 81.04,80.26
AMP_0  (via drill 0.3)
  Top 0.203: U10.10 126.41,67.46 126.25,67.31 v125.49,67.31 | U27.19 53.15,67.01 53.1,67.06 v52.34,67.06
  Bottom 0.203: v125.49,67.31 124.73,67.31 123.71,68.33 123.71,77.09 122.82,77.98 104.79,77.98 101.49,73.66 89.93,73.66 86.63,77.98 55.89,77.98 54.88,76.96 54.88,67.56 54.37,67.06 v52.34,67.06
AMP_1  (via drill 0.3)
  Top 0.203: U10.9 127.28,66.81 127.01,66.55 v126.25,66.55 | U27.20 55.44,67.51 v55.89,67.82
  Bottom 0.203: v126.25,66.55 124.47,66.55 123.08,67.94 123.08,76.71 122.31,77.47 105.04,77.47 101.74,73.15 89.68,73.15 86.37,77.47 56.66,77.47 55.39,76.2 55.39,68.33 v55.89,67.82
ANALOG/!DDS!  (via drill 0.3)
  Top 0.203: U3.5 100.32,51.97 v100.85,51.44
  Top 0.254: v64.78,62.99 R70.1
  Bottom 0.203: 99.84,52.45 76.34,52.45
  Bottom 0.254: v100.85,51.44 99.84,52.45 | 76.34,52.45 75.71,53.09 75.71,60.2 72.91,62.99 v64.78,62.99
BATT+
  Top 0.889: L3.4 79.85,40.98 79.18,41.15 F1.2 71.9,41.15 67.32,45.72 60.59,45.72 58.55,47.77 L5.1
BATT-
  Top 0.889: L3.3 CN3.3 CN3.4 79.79,43.7 79.39,43.69 72.91,43.69 68.09,48.51 60.34,48.51 58.94,49.78 58.93,49.77 L5.2
CH_0  (via drill 0.3)  (1 unrouted)
  Top 0.203: U18.11 22.91,23.33 22.87,23.37 v21.6,23.37 | 23.13,32.51 23.17,32.47 | 21.86,34.8 v21.6,34.8 21.6,33.02 22.11,32.51 22.87,32.51 22.91,32.47 U12.11 | U14.11 36.38,32.47 36.08,32.77 v36.08,34.8 36.08,36.83 35.45,37.47 34.05,37.47 33.56,37.96 33.56,39.61 33.54,39.62 R68.1 | v46.5,34.8 47,34.8 48.78,33.02 50.05,33.02 50.6,32.47 U16.11 | U20.11 37.39,23.33 37.35,23.37 v36.08,23.37 | U22.11 52.63,23.33 52.85,23.37 53.61,23.37 54.37,24.13 v54.37,34.8 | U25.11 65.29,23.37 v67.07,23.37 | U23.11 64.53,32.51 64.02,32.51 63.51,33.02 v63.51,34.8 | U17.11 98.53,23.33 98.31,23.11 v97.3,23.11 | U24.11 99.07,32.51 v97.3,32.51 | U13.11 113.34,32.47 113.3,32.51 v112.28,32.51 | v112.28,23.37 113.59,23.37 U19.11 | U15.11 127.56,32.47 127.52,32.51 v126.51,32.51 | U21.11 127.56,23.33 127.52,23.37 v126.51,23.37
  Route15 0.203: v21.6,34.8 v36.08,34.8 v46.5,34.8 v54.37,34.8 v63.51,34.8 | v97.3,34.8 112.28,34.8 | 112.28,34.8 v112.28,32.51 | 112.28,34.8 126,34.8 126.51,34.29 v126.51,32.51
  Bottom 0.203: v21.6,23.37 21.86,23.37 22.37,23.88 22.37,34.8 v21.6,34.8 | v36.08,34.8 36.08,32.77 36.59,32 36.59,23.88 v36.08,23.37 | v63.51,34.8 67.07,34.8 | 67.07,34.8 v97.3,34.8 v97.3,32.51 v97.3,23.11 | 67.07,34.8 v67.07,23.37 | v112.28,32.51 v112.28,23.37 | v126.51,32.51 v126.51,23.37
CH_1  (via drill 0.3)
  Top 0.203: U12.10 24.04,33.12 24.14,33.02 v24.65,33.02 v24.65,35.56 | U14.10 38.47,33.12 v38.88,33.27 v38.88,35.56 | U22.10 53.25,23.98 53.61,24.38 53.61,32.51 53.1,33.02 52.59,33.02 52.44,33.12 U16.10 50.71,33.12 50.31,33.53 50.31,34.54 v49.29,35.56 49.42,35.69 49.42,36.58 48.66,37.34 46.37,37.34 45.23,38.48 R69.1 | U18.10 24.04,23.98 24.14,23.88 v24.65,23.88 | U20.10 38.27,23.98 38.37,23.88 v38.88,23.88 | v66.31,35.56 v66.31,33.27 65.8,33.27 65.65,33.12 U23.10 | v66.31,24.13 65.8,24.13 65.65,23.98 U25.10 | U17.10 98.67,23.98 98.57,23.88 v98.06,23.88 | U13.10 114.47,33.12 114.57,33.27 v115.08,33.27 v115.08,35.56 | v115.08,23.88 114.57,23.88 114.47,23.98 U19.10 | U15.10 128.69,33.12 128.79,33.02 v129.3,33.02 | v129.3,24.13 128.79,24.13 128.69,23.98 U21.10 | U24.10 98.72,33.12 98.57,33.27 v98.06,33.27
  Route15 0.203: v24.65,35.56 v38.88,35.56 | v98.06,35.56 v115.08,35.56 128.79,35.56 129.3,35.05 v129.3,33.02 | v38.88,35.56 v49.29,35.56 | v38.88,35.56 v66.31,35.56
  Bottom 0.203: v24.65,23.88 24.65,27.43 25.67,28.45 25.67,32 v24.65,33.02 | v38.88,33.27 v38.88,23.88 | v66.31,35.56 v98.06,35.56 v98.06,33.27 v98.06,23.88 | v66.31,33.27 v66.31,24.13 | v115.08,33.27 113.3,31.5 113.3,27.43 115.08,25.65 v115.08,23.88 | v129.3,33.02 v129.3,24.13
CH_2  (via drill 0.3)
  Top 0.203: 22.87,33.78 22.88,33.77 U12.9 23.14,33.77 23.13,33.78 v23.13,36.32 | U18.9 22.88,24.63 23.13,24.64 v23.13,25.65 | U14.9 37.36,33.77 37.35,33.78 v37.35,36.32 | U16.9 51.59,33.77 51.58,33.78 | U20.9 37.36,24.63 37.35,24.64 v37.35,25.65 | U16.9 51.82,33.77 | v51.58,25.65 51.66,24.64 U22.9 | U16.9 51.58,33.85 v51.58,36.32 51.58,37.47 51.07,37.97 48.27,37.97 47.38,38.86 R67.1 | U23.9 64.78,33.78 v64.78,36.32 | U24.9 99.07,33.78 v99.07,36.32 | U13.9 113.3,33.78 v113.3,36.32 | U15.9 127.52,33.78 v127.52,36.32 | U25.9 65.03,24.63 64.78,24.64 v64.78,25.4 | U17.9 99.57,24.63 99.07,24.64 v99.07,25.65 | U19.9 113.56,24.63 113.3,24.64 v113.3,25.4 | U21.9 127.79,24.63 127.52,24.64 v127.52,25.65
  Route2 0.203: v37.35,36.32 v37.35,25.65 | v51.58,36.32 v51.58,25.65 | v23.13,25.65 v23.13,36.32 | v64.78,36.32 v64.78,25.4 | v99.07,36.32 v99.07,25.65 | v113.3,36.32 v113.3,25.4 | v127.52,36.32 v127.52,25.65
  Route15 0.203: v23.13,36.32 v37.35,36.32 v51.58,36.32 v64.78,36.32 | v99.07,36.32 v113.3,36.32 v127.52,36.32
  Bottom 0.203: v64.78,36.32 v99.07,36.32
CURRENT_MON
  Top 0.305: U11.7 148.73,45.09 149.11,44.7 R58.1
DGND  (via drill 0.3, 0.6)  (1 unrouted)
  Top 0.203: 53.61,40.64 U6.2 | 53.61,40.64 55.26,40.64 56.02,39.88 56.62,39.88 C11.2 57.58,39.84 57.67,39.75 58.58,39.75 R25.1 58.7,39.64 58.81,39.75 59.83,39.75 59.96,39.88 60.68,39.88 C10.2 | v52.72,40.64 53.61,40.64
  Top 0.61: L5.3 42.45,49.77 42.43,49.78
  other vias: 40.65,50.8 42.43,50.8 42.43,48.77 40.65,48.77 37.1,50.8 32.14,65.28 27.45,67.06
  pour Top (isolate 0.254): -0.24,36.58 27.7,36.58 27.7,40.64 23.13,40.64 23.13,47.75 29.22,47.75 29.22,46.74 43.07,46.74 43.07,52.83 60.72,52.83 60.72,58.93 70.88,58.93 70.88,80.26 -0.24,80.26
  pour Route15 (isolate 0.254): 36.34,39.62 54.62,39.62 54.62,51.56 39.89,51.56 39.89,53.85 36.34,53.85
  pour Top (isolate 0.254): 0,83 0,116 160,116 160,83
  pour Bottom (isolate 0.254): 70.88,73.15 70.88,80.26 -0.24,80.26 -0.24,36.58 23.13,36.58 23.13,47.75 43.45,47.75 43.45,52.83 60.72,52.83 60.72,58.93 70.88,58.93
  pour Bottom (isolate 0.254): 0,83 160,83 160,116 0,116
DISP1
  Top 0.203: U27.56 35.63,67.51 35.57,67.56 34.56,67.56 34.05,68.07 34.05,68.83 33.54,69.34 TP14.P$1 30.75,70.36 30.37,70.74 30.37,75.06 28.84,76.58 U29.9
DISP2
  Top 0.203: U27.57 34.35,67.01 TP13.P$1 30.37,68.07 29.73,68.71 29.73,74.8 28.6,75.94 U29.8
DISP3
  Top 0.203: U27.58 33.58,66.51 33.03,67.06 TP12.P$1 29.99,67.06 29.1,67.94 29.1,74.42 28.23,75.29 U29.7
DISP4
  Top 0.203: U27.61 37.34,65.01 36.84,64.52 32.02,64.52 31.76,64.26 TP11.P$1 29.1,64.26 28.59,64.77 28.59,74.04 27.99,74.64 U29.6
DRIVE01+  (via drill 0.3)
  Top 0.203: v20.84,29.46 20.84,30.48 21.6,31.24 23.28,31.24 U12.13
  Bottom 0.203: CN16.25 26.66,9.63 26.68,10.92 20.84,16.76 20.84,21.34 20.33,21.84 20.33,24.13 20.84,24.64 v20.84,29.46
DRIVE01-
  Top 0.203: CN16.50 26.66,7.85 25.41,9.14 25.41,11.18 24.91,11.68 22.11,11.68 20.84,12.95 20.84,21.34 21.35,21.84 22.11,21.84 22.44,22.03 U18.13
DRIVE02+  (via drill 0.3)
  Top 0.203: v24.61,30.52 U12.14
  Route2 0.203: CN16.24 27.94,7.61 27.95,7.62 27.95,14.48 25.92,16.51 25.92,29.21 v24.61,30.52
DRIVE02-  (via drill 0.3)
  Top 0.203: v25.92,14.48 25.92,20.57 25.16,21.34 24.14,21.34 24.1,21.38 U18.14
  Bottom 0.203: CN16.49 27.94,3.8 27.95,3.81 27.95,6.1 26.68,7.37 26.68,7.87 27.95,9.14 27.95,10.92 25.92,12.95 v25.92,14.48
DRIVE03+
  Top 0.203: CN16.23 29.2,9.63 29.22,9.65 29.22,12.7 26.68,14.99 26.68,29.21 26.18,29.72 24.65,29.72 24.5,29.87 U12.15
DRIVE03-
  Top 0.203: CN16.48 29.2,5.82 29.22,5.84 29.22,8 27.95,9.27 27.95,12.7 27.19,13.46 25.41,13.46 25.16,13.97 25.16,20.32 24.91,20.57 24.14,20.57 23.99,20.73 U18.15
DRIVE04+  (via drill 0.3)
  Top 0.203: v24.58,31.82 U12.12
  Route2 0.203: CN16.22 30.47,7.85 30.49,7.87 30.49,12.95 26.68,16.76 26.68,29.72 v24.58,31.82
DRIVE04-  (via drill 0.3)
  Top 0.203: v24.65,22.61 24.14,22.61 24.07,22.68 U18.12
  Bottom 0.203: CN16.47 30.48,3.8 30.49,3.81 30.49,6.1 29.22,7.37 29.22,7.87 30.49,9.14 30.49,11.94 25.92,16.51 25.92,21.34 v24.65,22.61
DRIVE05+  (via drill 0.3)
  Top 0.203: CN16.21 31.74,9.63 31.76,9.65 v31.76,13.46 | v29.73,28.19 29.16,28.77 U12.1
  Bottom 0.203: v31.76,13.46 29.22,16 29.22,27.43 v29.73,28.19
DRIVE05-
  Top 0.203: CN16.46 31.74,5.82 31.76,5.84 31.76,8 30.49,9.27 30.49,12.45 29.22,13.72 29.22,20.07 29.21,20.08 U18.1
DRIVE06+  (via drill 0.3)
  Top 0.203: v31.26,33.78 31.26,32.51 30.56,31.82 U12.5
  Route2 0.203: CN16.20 33.02,7.61 33.03,7.62 33.03,13.46 28.72,17.78 28.72,33.27 29.22,33.78 v31.26,33.78
DRIVE06-  (via drill 0.3)
  Top 0.203: U18.5 29.41,22.68 29.22,22.61 28.46,22.61 28.21,22.86 v27.7,22.86
  Bottom 0.203: CN16.45 33.02,3.8 33.03,3.81 33.03,6.1 31.76,7.37 31.76,7.87 33.03,9.14 33.03,10.41 26.68,16.76 26.68,21.84 v27.7,22.86
DRIVE07+
  Top 0.203: CN16.19 34.28,9.63 34.3,9.65 34.3,12.95 31.51,15.75 31.51,29.21 31,29.72 30.24,29.72 30.09,29.87 U12.2
DRIVE07-
  Top 0.203: CN16.44 34.28,5.82 34.3,5.84 34.3,8 33.03,9.27 33.03,13.46 30.59,15.9 30.59,20.47 30.34,20.73 U18.2
DRIVE08+  (via drill 0.3)
  Top 0.203: U12.4 30.06,31.17 30.24,31.24 v31.51,31.24
  Route2 0.203: CN16.18 35.56,7.61 35.57,7.62 35.57,11.94 31.51,16 v31.51,31.24
DRIVE08-  (via drill 0.3)
  Top 0.203: U18.4 29.22,22.1 28.21,22.1 27.95,21.84 v27.7,21.84
  Bottom 0.203: CN16.43 35.55,6.09 34.3,7.34 34.3,7.87 35.57,9.14 35.57,10.67 34.81,11.43 32.78,11.43 27.7,16.51 v27.7,21.84
DRIVE09+  (via drill 0.3)
  Top 0.203: U14.13 36.41,31.17 36.08,31.5 v35.32,31.5
  Bottom 0.203: CN16.17 36.82,9.63 36.84,9.65 36.84,12.45 35.32,13.97 35.32,21.08 34.56,21.84 34.56,24.13 35.32,24.89 v35.32,31.5
DRIVE09-
  Top 0.203: CN16.42 36.82,5.82 36.84,5.84 36.84,8 35.57,9.27 35.57,12.7 34.56,13.72 34.56,21.34 35.07,21.84 36.34,21.84 36.52,22.03 U20.13
DRIVE10+  (via drill 0.3)
  Top 0.203: U14.14 36.38,30.52 36.34,30.48 35.32,30.48 v34.56,29.72
  Route2 0.203: CN16.16 38.1,7.61 38.11,7.62 38.11,10.41 34.56,13.97 v34.56,29.72
DRIVE10-  (via drill 0.3)
  Top 0.203: v37.35,13.21 35.32,15.24 35.32,20.83 35.83,21.34 36.34,21.34 36.38,21.38 U20.14
  Bottom 0.203: CN16.41 38.1,3.8 38.11,3.81 38.11,6.07 36.84,7.34 36.84,7.87 38.11,9.14 38.11,9.91 37.35,10.67 v37.35,13.21
DRIVE11+
  Top 0.203: 39.38,9.14 39.36,9.16 CN16.15 39.36,9.63 39.38,9.65 39.38,11.43 39.64,11.68 39.64,29.46 39.38,29.72 38.37,29.72 38.22,29.87 U14.15
DRIVE11-
  Top 0.203: CN16.40 39.51,5.84 39.49,5.86 39.49,7.89 38.11,9.27 38.11,9.91 38.88,10.67 38.88,20.32 38.47,20.73 U20.15
DRIVE12+  (via drill 0.3)
  Top 0.203: v39.64,31.75 38.37,31.75 38.3,31.82 U14.12
  Route2 0.203: CN16.14 40.64,7.61 40.65,7.62 40.65,10.67 39.64,11.68 v39.64,31.75
DRIVE12-  (via drill 0.3)
  Top 0.203: U20.12 38.3,22.68 38.37,22.61 v38.88,22.61
  Bottom 0.203: CN16.39 40.64,3.8 40.65,3.81 40.65,6.07 39.38,7.34 39.38,7.87 40.65,9.14 40.65,9.91 38.88,11.68 v38.88,22.61
DRIVE13+  (via drill 0.3)
  Top 0.203: CN16.13 41.9,9.63 41.92,9.65 v41.92,17.02 | U14.1 42.44,29.22 42.43,29.21 v41.92,29.21
  Bottom 0.203: v41.92,17.02 40.91,17.78 40.91,28.19 v41.92,29.21
DRIVE13-
  Top 0.203: CN16.38 41.92,5.71 42.03,5.74 42.03,7.89 40.65,9.27 40.65,9.91 40.91,10.16 40.91,19.05 41.94,20.08 U20.1
DRIVE14+  (via drill 0.3)
  Top 0.203: U14.5 42.5,31.82 42.43,31.75 v41.92,31.75
  Route2 0.203: CN16.12 43.17,7.85 43.19,7.87 43.19,10.67 40.91,12.95 40.91,30.73 v41.92,31.75
DRIVE14-  (via drill 0.3)
  Top 0.203: 42.18,22.61 v41.92,22.61 42.43,22.61 42.5,22.68 U20.5
  Bottom 0.203: CN16.37 43.18,3.8 43.19,3.81 43.19,6.07 41.92,7.34 41.92,7.87 43.19,9.14 43.19,10.16 42.69,10.67 42.69,21.84 v41.92,22.61
DRIVE15+
  Top 0.203: CN16.11 44.44,9.63 44.46,9.65 44.46,13.21 45.48,14.22 45.48,28.7 44.31,29.87 U14.2
DRIVE15-
  Top 0.203: CN16.36 44.44,5.82 44.46,5.84 44.46,8 43.19,9.27 43.19,9.91 43.96,10.67 43.96,13.72 44.97,14.73 44.97,20.32 44.56,20.73 U20.2
DRIVE16+  (via drill 0.3)
  Top 0.203: v44.97,31.5 44.46,31.5 44.14,31.17 U14.4
  Route2 0.203: CN16.10 45.72,7.61 45.73,7.62 45.73,23.62 44.97,24.38 v44.97,31.5
DRIVE16-  (via drill 0.3)
  Top 0.203: 44.46,22.1 v44.72,22.1 44.21,22.1 44.14,22.03 U20.4
  Bottom 0.203: CN16.35 45.72,3.8 45.73,3.81 45.73,6.07 44.46,7.34 44.46,7.87 45.73,9.14 45.73,9.91 44.97,10.67 44.97,21.59 v44.72,22.1
DRIVE17+  (via drill 0.3)
  Top 0.203: CN16.9 46.98,9.63 47,9.65 47,19.05 v48.27,20.32 | U16.13 50.74,31.17 50.56,30.99 48.78,30.99 v48.27,31.5
  Bottom 0.203: v48.27,20.32 v48.27,31.5
DRIVE17-
  Top 0.203: CN16.34 46.98,5.82 47,5.84 47,8 45.73,9.27 45.73,9.91 46.5,10.67 46.5,20.32 48.02,21.84 49.8,21.84 49.98,22.03 U22.13
DRIVE18+  (via drill 0.3)
  Top 0.203: v46.5,29.72 47.26,30.48 50.56,30.48 50.6,30.52 U16.14
  Route2 0.203: CN16.8 48.25,7.85 48.27,7.87 48.27,9.91 46.5,11.68 v46.5,29.72
DRIVE18-  (via drill 0.3)
  Top 0.203: v47.77,18.29 49.8,20.32 49.8,20.83 50.35,21.38 U22.14
  Bottom 0.203: CN16.33 48.26,3.8 48.27,3.81 48.27,6.07 47,7.34 47,7.87 48.27,9.14 48.27,9.91 47.77,10.41 v47.77,18.29
DRIVE19+  (via drill 0.3)
  Top 0.203: CN16.7 49.52,9.63 49.54,9.65 49.54,12.95 v51.07,14.48 | U16.15 50.46,29.87 v50.05,29.46
  Bottom 0.203: v51.07,14.48 51.07,24.38 50.05,25.4 v50.05,29.46
DRIVE19-
  Top 0.203: CN16.32 49.52,5.82 49.54,5.84 49.54,8 48.27,9.27 48.27,9.91 49.04,10.67 49.04,13.97 50.31,15.24 50.31,20.32 50.71,20.73 U22.15
DRIVE20+  (via drill 0.3)
  Top 0.203: U16.12 51.39,31.82 51.32,31.75 v50.05,31.75
  Route2 0.203: CN16.6 50.8,7.61 50.81,7.62 50.81,10.92 49.04,12.7 49.04,30.23 50.05,31.24 v50.05,31.75
DRIVE20-  (via drill 0.3)
  Top 0.203: v50.05,22.86 50.56,22.86 50.74,22.68 U22.12
  Bottom 0.203: CN16.31 50.8,3.8 50.81,3.81 50.81,6.07 49.54,7.34 49.54,7.87 50.81,9.14 50.81,10.16 50.05,10.92 v50.05,22.86
DRIVE21+  (via drill 0.3)
  Top 0.203: U16.1 56.67,29.22 56.66,29.21 v56.15,29.21
  Bottom 0.203: CN16.5 52.06,9.63 52.08,9.65 52.08,17.53 54.62,20.07 54.62,27.69 v56.15,29.21
DRIVE21-
  Top 0.203: CN16.30 52.06,5.82 52.08,5.84 52.08,8 50.81,9.27 50.81,12.45 52.59,14.22 56.15,14.22 57.67,15.75 57.67,20.07 57.66,20.08 U22.1
DRIVE22+  (via drill 0.3)
  Top 0.203: v56.15,31.75 56.66,31.75 56.73,31.82 U16.5
  Route2 0.203: CN16.4 53.34,7.61 53.35,7.62 53.35,17.78 54.62,19.05 54.62,30.23 v56.15,31.75
DRIVE22-  (via drill 0.3)
  Top 0.203: U22.5 56.73,22.68 56.66,22.61 v56.15,22.61
  Bottom 0.203: CN16.29 53.34,3.8 53.35,3.81 53.35,6.07 52.08,7.34 52.08,7.87 53.35,9.14 53.35,17.78 55.13,19.56 55.13,21.59 v56.15,22.61
DRIVE23+
  Top 0.203: CN16.3 54.6,9.63 54.62,9.65 54.62,11.68 55.39,12.45 56.4,12.45 59.96,16 59.96,29.21 59.45,29.72 58.69,29.72 58.53,29.87 U16.2
DRIVE23-
  Top 0.203: CN16.28 54.6,5.82 54.62,5.84 54.62,8 53.35,9.27 53.35,12.95 53.61,13.21 56.15,13.21 59.2,16.26 59.2,20.07 58.53,20.73 U22.2
DRIVE24+  (via drill 0.3)
  Top 0.203: v59.2,31.24 58.69,31.24 58.62,31.17 U16.4
  Route2 0.203: CN16.2 55.97,7.9 55.89,7.92 55.89,11.94 59.96,16 59.96,30.48 v59.2,31.24
DRIVE24-  (via drill 0.3)
  Top 0.203: v59.2,22.1 58.43,22.1 58.36,22.03 U22.4
  Bottom 0.203: CN16.27 55.88,3.8 55.89,3.81 55.89,5.84 57.42,7.37 57.93,7.37 58.43,7.87 58.43,21.34 v59.2,22.1
DRIVE25+  (via drill 0.3)
  Top 0.203: v96.53,17.27 96.53,30.73 97.11,31.17 U24.13
  Bottom 0.203: CN17.25 102.88,9.65 102.88,10.92 v96.53,17.27
DRIVE25-
  Top 0.203: CN17.50 102.88,5.84 102.88,7.87 101.61,9.14 101.61,10.92 97.8,14.73 97.8,21.84 98.13,22.03 U17.13
DRIVE26+  (via drill 0.3)
  Top 0.203: v101.61,31.24 100.85,30.48 99.58,30.48 99.54,30.52 U24.14
  Route2 0.203: CN17.24 104.14,7.61 104.15,7.62 104.15,14.22 102.12,16.26 102.12,30.73 v101.61,31.24
DRIVE26-  (via drill 0.3)
  Top 0.203: v101.36,20.57 101.36,21.08 101.06,21.38 U17.14
  Bottom 0.203: CN17.49 104.14,3.8 104.15,3.81 104.15,5.97 102.88,7.24 102.88,8 104.15,9.27 104.15,13.97 101.36,16.76 v101.36,20.57
DRIVE27+
  Top 0.203: CN17.23 105.42,9.65 105.42,11.68 102.38,14.73 102.38,29.21 101.72,29.87 U24.15
DRIVE27-
  Top 0.203: CN17.48 105.38,5.8 105.42,5.84 105.42,7.87 104.15,9.14 104.15,11.94 101.87,14.22 101.87,18.54 100.6,19.81 100.6,20.32 100.19,20.73 U17.15
DRIVE28+  (via drill 0.3)
  Top 0.203: v100.85,32 100.6,32 100.27,31.82 U24.12
  Route2 0.203: CN17.22 106.68,7.61 106.69,7.62 106.69,12.45 102.63,16.51 102.63,31.5 102.12,32 v100.85,32
DRIVE28-  (via drill 0.3)
  Top 0.203: U17.12 99.77,22.68 99.84,22.61 v100.85,22.61
  Bottom 0.203: CN17.47 106.65,4.02 106.69,4.06 106.69,5.97 105.42,7.24 105.42,8 106.69,9.27 106.69,12.45 102.12,17.02 102.12,21.34 v100.85,22.61
DRIVE29+
  Top 0.203: CN17.21 107.96,9.65 107.96,28.7 107.44,29.22 U24.1
DRIVE29-
  Top 0.203: CN17.46 107.92,5.8 107.96,5.84 107.96,7.87 106.69,9.14 106.69,11.68 103.39,14.99 103.39,19.81 103.65,20.07 104.41,20.07 104.42,20.08 U17.1
DRIVE30+  (via drill 0.3)
  Top 0.203: U24.5 104.59,31.82 104.41,31.75 v103.9,31.75
  Route2 0.203: CN17.20 109.22,7.61 109.23,7.62 109.23,10.92 104.92,15.24 104.92,30.73 v103.9,31.75
DRIVE30-  (via drill 0.3)
  Top 0.203: v103.39,22.61 104.15,22.61 104.22,22.68 U17.5
  Bottom 0.203: CN17.45 109.22,3.8 109.23,3.81 109.23,5.97 107.96,7.24 107.96,8 109.23,9.27 109.23,10.92 102.88,17.27 102.88,22.1 v103.39,22.61
DRIVE31+
  Top 0.203: CN17.19 110.5,9.65 110.5,13.21 108.47,15.24 108.47,29.21 107.81,29.87 U24.2
DRIVE31-  (via drill 0.3)
  Top 0.203: CN17.44 110.46,5.8 110.5,5.84 110.5,7.87 109.23,9.14 v109.23,12.19 | U17.2 106.8,20.73 106.95,20.57 v106.95,19.3
  Bottom 0.203: v109.23,12.19 106.95,14.48 v106.95,19.3
DRIVE32+  (via drill 0.3)
  Top 0.203: U24.4 106.37,31.17 106.44,31.24 v107.2,31.24
  Route2 0.203: CN17.18 111.76,7.61 111.77,7.62 111.77,11.94 110,13.72 107.71,13.72 105.68,15.75 105.68,29.72 v107.2,31.24
DRIVE32-  (via drill 0.3)
  Top 0.203: v106.95,22.1 106.44,22.1 106.37,22.03 U17.4
  Bottom 0.203: CN17.43 111.76,3.8 111.77,3.81 111.77,5.97 110.5,7.24 110.5,8 111.77,9.27 111.77,11.94 107.96,15.75 107.96,21.08 v106.95,22.1
DRIVE33+  (via drill 0.3)
  Top 0.203: v111.52,31.24 112.54,31.24 112.61,31.17 U13.13
  Bottom 0.203: CN17.17 113.04,9.65 113.04,12.7 111.52,14.22 v111.52,31.24
DRIVE33-
  Top 0.203: CN17.42 113,5.8 113.04,5.84 113.04,7.87 111.77,9.14 111.77,11.94 111.52,12.19 111.52,21.84 111.7,22.03 U19.13
DRIVE34+  (via drill 0.3)
  Top 0.203: v115.84,31.24 115.08,30.48 113.67,30.48 U13.14
  Route2 0.203: CN17.16 114.3,7.61 114.31,7.62 114.31,10.41 115.84,11.94 v115.84,31.24
DRIVE34-  (via drill 0.3)
  Top 0.203: v112.28,20.32 112.28,21.08 112.58,21.38 U19.14
  Bottom 0.203: CN17.41 114.3,3.8 114.31,3.81 114.31,5.97 113.04,7.24 113.04,8 114.31,9.27 114.31,12.45 112.28,14.48 v112.28,20.32
DRIVE35+
  Top 0.203: CN17.15 115.58,9.65 115.58,11.68 115.84,11.94 115.84,29.46 115.43,29.87 U13.15
DRIVE35-
  Top 0.203: CN17.40 115.54,5.8 115.58,5.84 115.58,7.87 114.31,9.14 114.31,12.45 115.08,13.21 115.08,20.32 114.67,20.73 U19.15
DRIVE36+  (via drill 0.3)
  Top 0.203: U13.12 114.89,31.82 v115.33,32.26
  Route2 0.203: CN17.14 116.84,7.61 116.85,7.62 116.85,11.43 116.35,11.94 116.35,30.48 116.6,30.73 116.6,31.75 116.09,32.26 v115.33,32.26
DRIVE36-  (via drill 0.3)
  Top 0.203: U19.12 114.5,22.68 114.57,22.61 v115.08,22.61
  Bottom 0.203: CN17.39 116.81,4.02 116.85,4.06 116.85,5.97 115.58,7.24 115.58,8 116.85,9.27 116.85,11.43 115.08,13.21 v115.08,22.61
DRIVE37+  (via drill 0.3)
  Top 0.203: v118.12,29.21 118.63,29.21 118.64,29.22 U13.1
  Bottom 0.203: CN17.13 118.12,9.65 118.12,13.97 117.36,14.73 117.36,22.1 118.12,22.86 v118.12,29.21
DRIVE37-
  Top 0.203: CN17.38 118.08,7.92 116.85,9.14 116.85,14.22 117.36,14.73 117.36,19.81 117.63,20.08 U19.1
DRIVE38+  (via drill 0.3)
  Top 0.203: 117.87,31.75 v118.12,31.75 118.63,31.75 118.7,31.82 U13.5
  Route2 0.203: CN17.12 119.38,7.61 119.39,7.62 119.39,31.24 118.89,31.75 v118.12,31.75
DRIVE38-  (via drill 0.3)
  Top 0.203: U19.5 120.34,22.68 120.92,23.11 v120.92,23.62
  Bottom 0.203: CN17.37 119.38,3.8 119.39,3.81 119.39,5.97 118.12,7.24 118.12,8 119.39,9.27 119.39,22.1 v120.92,23.62
DRIVE39+
  Top 0.203: CN17.11 120.66,9.65 120.66,16.26 122.19,17.78 122.19,28.7 121.02,29.87 U13.2
DRIVE39-
  Top 0.203: CN17.36 120.62,5.8 120.66,5.84 120.66,7.87 119.39,9.14 119.39,15.75 121.17,17.53 121.17,20.57 121.02,20.73 U19.2
DRIVE40+  (via drill 0.3)
  Top 0.203: v121.68,31.5 121.43,31.5 121.1,31.17 U13.4
  Route2 0.203: CN17.10 121.92,7.61 121.93,7.62 121.93,29.97 121.68,30.23 v121.68,31.5
DRIVE40-  (via drill 0.3)
  Top 0.203: U19.4 120.34,22.03 120.41,22.1 v120.92,22.1
  Bottom 0.203: CN17.35 121.89,4.02 121.93,4.06 121.93,5.97 120.66,7.24 120.66,8 121.93,9.27 121.93,10.67 120.66,11.94 120.66,21.59 120.92,21.84 v120.92,22.1
DRIVE41+  (via drill 0.3)
  Top 0.203: v124.22,31.5 124.47,31.5 124.98,30.99 126,30.99 126.18,31.17 U15.13
  Bottom 0.203: CN17.9 123.2,9.65 123.2,30.48 v124.22,31.5
DRIVE41-
  Top 0.203: CN17.34 123.16,5.8 123.2,5.84 123.2,7.87 121.93,9.14 121.93,16.51 123.2,17.78 123.2,21.59 123.71,22.1 126.76,22.1 126.83,22.03 U21.13
DRIVE42+  (via drill 0.3)
  Top 0.203: U15.14 126.04,30.52 v124.98,29.46
  Route2 0.203: CN17.8 124.46,7.61 124.47,7.62 124.47,10.67 124.98,11.18 v124.98,29.46
DRIVE42-  (via drill 0.3)
  Top 0.203: U21.14 125.02,21.38 v123.97,20.32
  Bottom 0.203: CN17.33 124.46,3.8 124.47,3.81 124.47,5.97 123.2,7.24 123.2,8 124.47,9.27 124.47,10.67 123.97,11.18 v123.97,20.32
DRIVE43+  (via drill 0.3)
  Top 0.203: U15.15 126.91,29.87 v125.74,28.7
  Bottom 0.203: CN17.7 125.74,9.65 v125.74,28.7
DRIVE43-
  Top 0.203: CN17.32 125.7,5.8 125.74,5.84 125.74,7.87 124.47,9.14 124.47,19.56 125.64,20.73 U21.15
DRIVE44+  (via drill 0.3)
  Top 0.203: v125.49,31.75 126.51,31.75 126.58,31.82 U15.12
  Route2 0.203: CN17.6 127,7.61 127.01,7.62 127.01,16.26 127.52,16.76 127.52,23.88 126.51,24.89 126.51,30.73 v125.49,31.75
DRIVE44-  (via drill 0.3)
  Top 0.203: v129.55,22.86 129.05,22.86 128.86,22.68 U21.12
  Bottom 0.203: CN17.31 127,3.8 127.01,3.81 127.01,5.97 125.74,7.24 125.74,8 127.01,9.27 127.01,16.26 129.55,18.8 v129.55,22.86
DRIVE45+  (via drill 0.3)
  Top 0.203: v131.84,29.21 132.86,29.21 132.87,29.22 U15.1
  Bottom 0.203: CN17.5 128.28,9.65 128.28,16.76 130.32,18.8 130.32,27.69 v131.84,29.21
DRIVE45-
  Top 0.203: CN17.30 128.24,5.8 128.28,5.84 128.28,7.87 127.01,9.14 127.01,11.43 133.87,18.29 133.87,20.07 134.12,20.08 U21.1
DRIVE46+  (via drill 0.3)
  Top 0.203: v131.84,31.75 132.6,31.75 132.67,31.82 U15.5
  Route2 0.203: CN17.4 129.54,7.61 129.55,7.62 129.55,10.92 130.32,11.68 130.32,30.23 v131.84,31.75
DRIVE46-  (via drill 0.3)
  Top 0.203: U21.5 133.04,22.68 132.35,23.37 v131.33,23.37
  Bottom 0.203: CN17.29 129.54,3.8 129.55,3.81 129.55,5.97 128.28,7.24 128.28,8 129.55,9.27 129.55,17.27 130.82,18.54 130.82,22.86 v131.33,23.37
DRIVE47+
  Top 0.203: CN17.3 130.82,9.65 130.82,13.72 135.65,18.54 135.65,29.21 134.99,29.87 U15.2
DRIVE47-
  Top 0.203: CN17.28 130.78,5.8 130.82,5.84 130.82,7.87 129.55,9.14 129.55,13.21 135.14,18.8 135.14,20.57 134.99,20.73 U21.2
DRIVE48+  (via drill 0.3)
  Top 0.203: v135.65,31.24 134.89,31.24 134.82,31.17 U15.4
  Route2 0.203: CN17.2 132.08,7.61 132.09,7.62 132.09,19.3 133.62,20.83 133.62,29.21 v135.65,31.24
DRIVE48-  (via drill 0.3)
  Top 0.203: v131.84,22.35 132.35,22.35 132.67,22.03 U21.4
  Bottom 0.203: CN17.27 132.08,3.8 132.09,3.81 132.09,5.97 130.82,7.24 130.82,8 132.09,9.27 132.09,10.67 131.33,11.43 131.33,21.84 v131.84,22.35
DRIVE49+
  Top 0.203: CN16.1 57.27,9.63 57.16,9.91 57.16,12.45 60.47,15.75 60.47,29.97 61.48,30.99 62.5,30.99 62.68,31.17 U23.13
DRIVE49-
  Top 0.203: CN16.26 57.14,5.82 57.16,5.84 57.16,7.11 57.42,7.37 57.93,7.37 58.43,7.87 58.43,12.95 60.97,15.49 60.97,20.32 62.5,21.84 63.77,21.84 63.95,22.03 U25.13
DRIVE50+  (via drill 0.3)
  Top 0.203: v67.32,18.29 67.32,22.1 67.83,22.61 67.83,29.46 66.82,30.48 66.31,30.48 66.27,30.52 U23.14
  Bottom 0.203: CN17.1 133.36,9.65 133.36,7.62 134.89,6.1 134.89,5.33 133.36,3.81 133.36,3.05 132.6,2.29 102.12,2.29 101.36,3.05 101.36,8.13 100.6,8.89 100.6,10.67 92.98,18.29 v67.32,18.29
DRIVE50-  (via drill 0.3)
  Top 0.203: CN17.26 133.32,5.8 133.36,5.84 133.36,3.05 132.6,2.29 102.12,2.29 101.36,3.05 101.36,8.13 100.6,8.89 100.6,10.67 94.25,17.02 v92.72,17.02 | v67.32,17.02 66.56,17.78 66.56,20.83 66.01,21.38 U25.14
  Bottom 0.203: v67.32,17.02 v92.72,17.02
EXT/!INT!  (via drill 0.3)
  Top 0.203: U3.1 98.34,51.84 v97.93,51.44
  Top 0.254: v64.78,60.96 R71.1
  Bottom 0.254: v97.93,51.44 76.34,51.44 74.94,52.83 74.94,57.91 71.9,60.96 v64.78,60.96
EXT_IN_+
  Top 0.305: CN2.1 CN2.2 L2.4
EXT_IN_-
  Top 0.305: CN2.3 CN2.4 L2.3
FLAME_SYNC
  Top 0.203: U29.2 26.43,72.04 | 26.43,72.64 26.43,73.28 | 26.43,73.28 26.43,73.66 26.1,73.99 U29.5 | U29.4 26.37,73.34 26.43,73.28 | U29.3 26.39,72.69 26.43,72.64 | U27.66 36.74,62.51 36.34,62.1 36.34,61.47 35.83,60.96 29.48,60.96 29.22,60.71 27.19,60.71 26.43,61.47 26.43,72.04 | 26.43,72.04 26.43,72.64
FSEL
  Top 0.203: CN19.11 19.06,52.07 21.6,52.07 24.4,54.86 31.51,54.86 36.65,60.01 U27.71
FSYNC  (via drill 0.3)
  Top 0.203: v38.37,56.9 38.37,57.98 U27.75
  Bottom 0.203: CN19.1 19.06,39.37 21.35,39.37 23.38,41.4 23.38,54.86 25.41,56.9 v38.37,56.9
IOUT+  (via drill 0.3)
  Top 0.203: U12.3 29.18,30.52 29.22,30.48 v30.49,30.48 | v41.92,30.48 43.33,30.48 U14.3 | U16.3 56.7,30.52 56.66,30.48 v56.15,30.48 | U23.3 70.63,30.48 v69.36,30.48 | U24.3 104.92,30.48 v103.9,30.48 | U13.3 119.14,30.48 v118.12,30.48 | v132.35,30.48 133.36,30.48 U15.3 136.75,30.52 137.17,30.1 137.17,27.94 137.68,27.43 138.44,27.43 139.6,27.42 L4.1
  Route15 0.203: v30.49,30.48 v41.92,30.48 v56.15,30.48 v69.36,30.48 | v95.26,30.48 v103.9,30.48 v118.12,30.48 v132.35,30.48
  Bottom 0.203: v69.36,30.48 v95.26,30.48
IOUT-  (via drill 0.3)
  Top 0.203: U18.3 29.18,21.38 29.22,21.34 v30.75,21.34 | v41.92,21.34 43.33,21.34 U20.3 | 57.63,21.38 U22.3 56.7,21.38 56.66,21.34 v56.15,21.34 | U21.3 133.62,21.34 v132.35,21.34 | U25.3 70.37,21.34 v69.36,21.34 | U17.3 105.17,21.34 v103.9,21.34 | U19.3 119.14,21.34 v118.12,21.34 | L4.2 139.57,25.42 v137.56,25.4
  Route15 0.203: v30.75,21.34 v41.92,21.34 v56.15,21.34 | v56.15,21.34 v69.36,21.34 | v56.15,21.34 v56.15,21.35 | v94.25,21.34 v103.9,21.34 v118.12,21.34 v132.35,21.34
  Bottom 0.203: v69.36,21.34 v94.25,21.34 | v137.56,25.4 137.56,21.72 137.17,21.34 v132.35,21.34
LED_INT/!EXT!  (via drill 0.3)
  Top 0.203: U29.11 v17.69,77.24
  Bottom 0.203: CN20.4 4.86,73.17 5.73,74.09 17.03,74.09 17.67,74.68 17.67,76.83 v17.69,77.24
MCLK  (via drill 0.3)
  Top 0.203: U27.64 36.09,63.51 35.83,63.25 35.83,61.72 35.57,61.47 v28.97,61.47
  Bottom 0.203: v28.97,61.47 27.06,61.47 22.24,56.64 22.24,51.56 21.48,50.8 CN19.12
N$1
  Top 0.203: D5.C 16.73,98.85 19.32,96.27 22.24,96.27 24.02,94.44 26.1,94.44 CN7.3
N$2  (via drill 0.3)
  Top 0.203: U27.15 52.61,65.01 52.59,65.02 47,65.02 v45.23,63.25 | R69.2 v45.23,43.31
  Bottom 0.203: v45.23,43.31 v45.23,63.25
N$3  (via drill 0.3)
  Top 0.203: U27.16 53,65.51 52.97,65.53 45.73,65.53 v43.45,63.25 | R68.2 v35.07,41.91
  Bottom 0.203: v43.45,63.25 43.45,52.83 43.7,52.45 43.7,45.85 41.92,44.07 37.23,44.07 v35.07,41.91
N$4
  Top 0.305: L2.1 86.23,73.17 87.39,73.15 90.3,73.15 R10.1
N$5
  Top 0.203: U29.18 16.06,72.69 15.51,72.14 15.51,71.5 14.62,70.61 14.62,69.6 14.11,69.09 13.06,69.09 R83.1
N$6
  Top 0.203: U29.19 18.08,72.04 17.79,71.75 17.79,70.36 18.05,70.1 18.05,69.1 R77.2
N$7
  Top 0.305: D5.A 19.27,108.54 18.81,108.08 R60.1
N$8
  Top 0.254: D6.A 94.27,108.86 92.98,107.57 R61.1
N$9
  Top 0.203: U3.9 98.82,56.01 99.07,55.75 100.09,55.75 100.32,55.98 U3.6
N$10
  Top 0.305: U26.4 34.48,49.77 C52.1
N$11
  Top 0.305: R12.1 103.9,57.15 104.41,57.66 R7.2
N$12
  Top 0.305: C3.2 91.24,61.72 91.96,61.72 92.2,61.96 R13.1 93.27,62 U2.5 93.22,64.77 92.72,64.77 92.49,65.01 R8.2
N$13
  Top 0.305: R2.3 112.66,75.69 112.16,75.18 R1.2
N$14
  Top 0.305: 95.77,73.14 95.77,74.3 | 95.77,74.3 95.77,76.71 95.26,77.22 R11.2 | 95.77,73.14 R16.1 97.51,72.97 99.2,72.97 99.2,73.03 C7.2 | U2.2 94.57,70.17 95.77,71.37 95.77,73.14 | D2.3 101.36,74.68 100.98,74.3 95.77,74.3
N$15
  Top 0.305: U26.3 37.16,47.69 37.1,48.01 37.1,49.02 37.61,49.53 38.88,49.53 39.38,49.02 R64.2
N$16
  Top 0.305: U1.7 114.89,62.92 115.2,62.61 C6.1 114.98,58.5 R17.2 115.57,51.8 114.95,51.18 111.65,51.18 110.25,49.78 R19.1
N$17  (via drill 0.3)
  Top 0.203: L4.3 148.08,25.42 v152.16,25.4